# EAGLE design Combo Board (EAGLE 7.5.0)
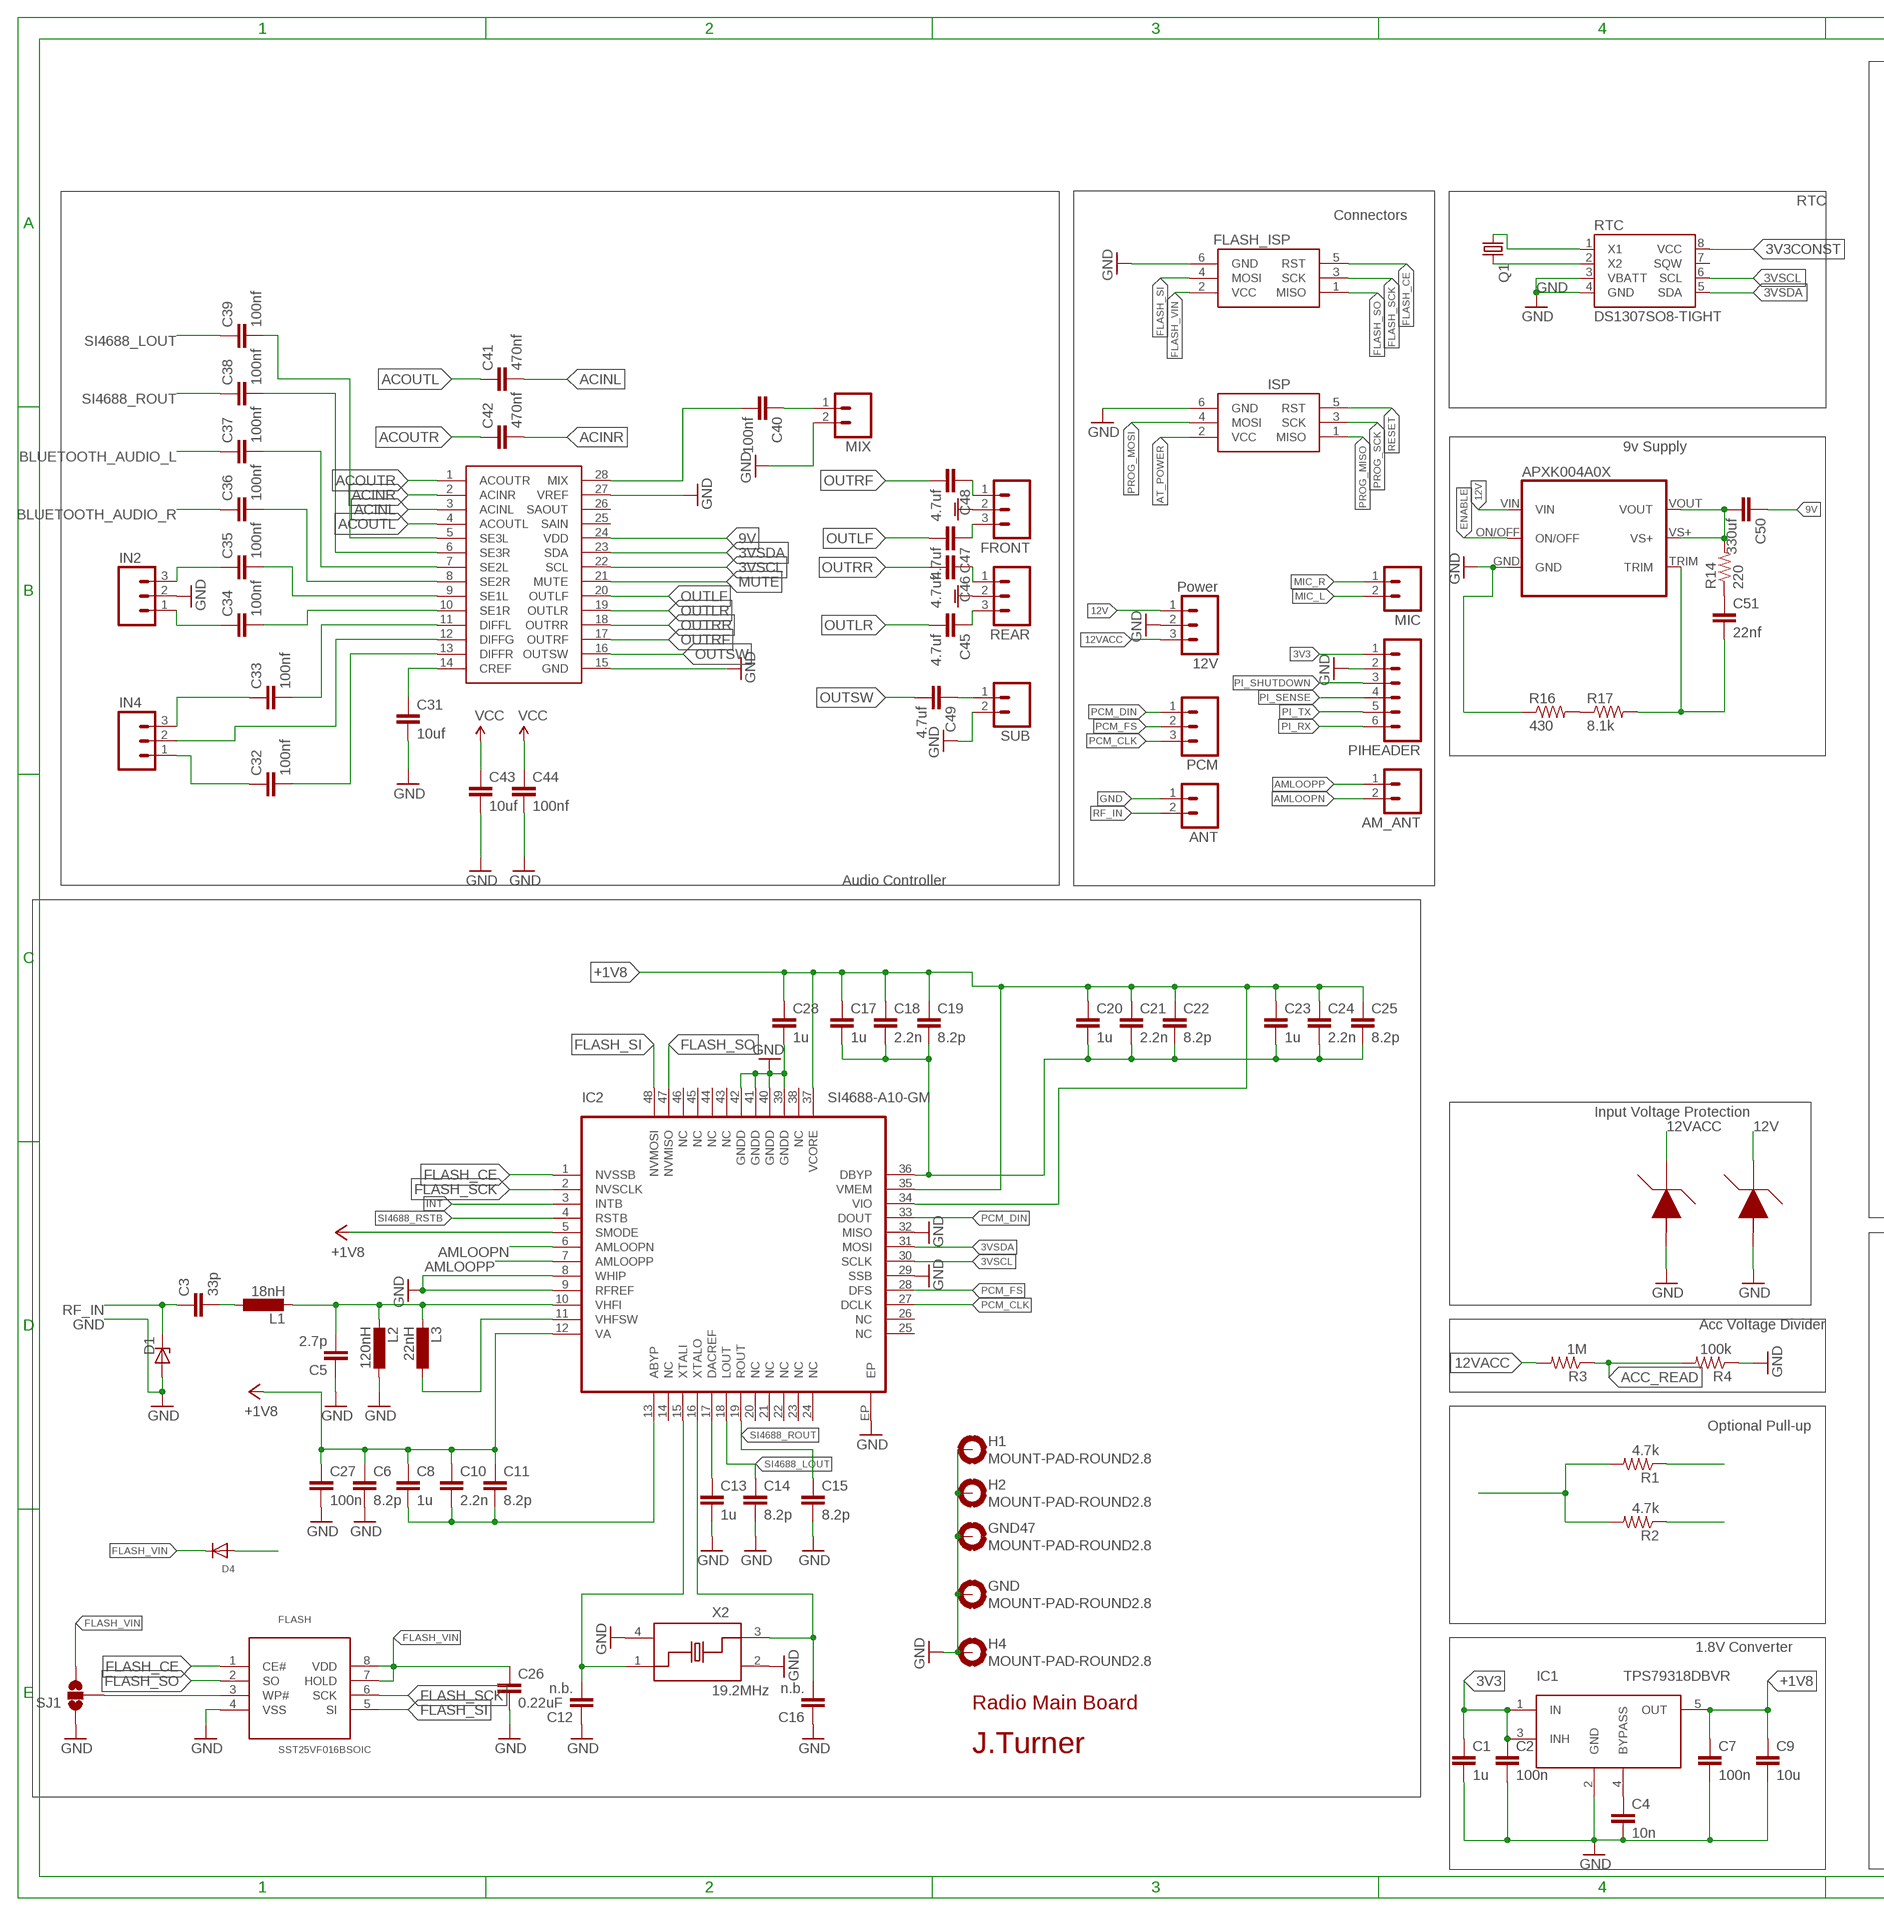
[diagram p0: schematic, sheet 1, part 1 of 2]
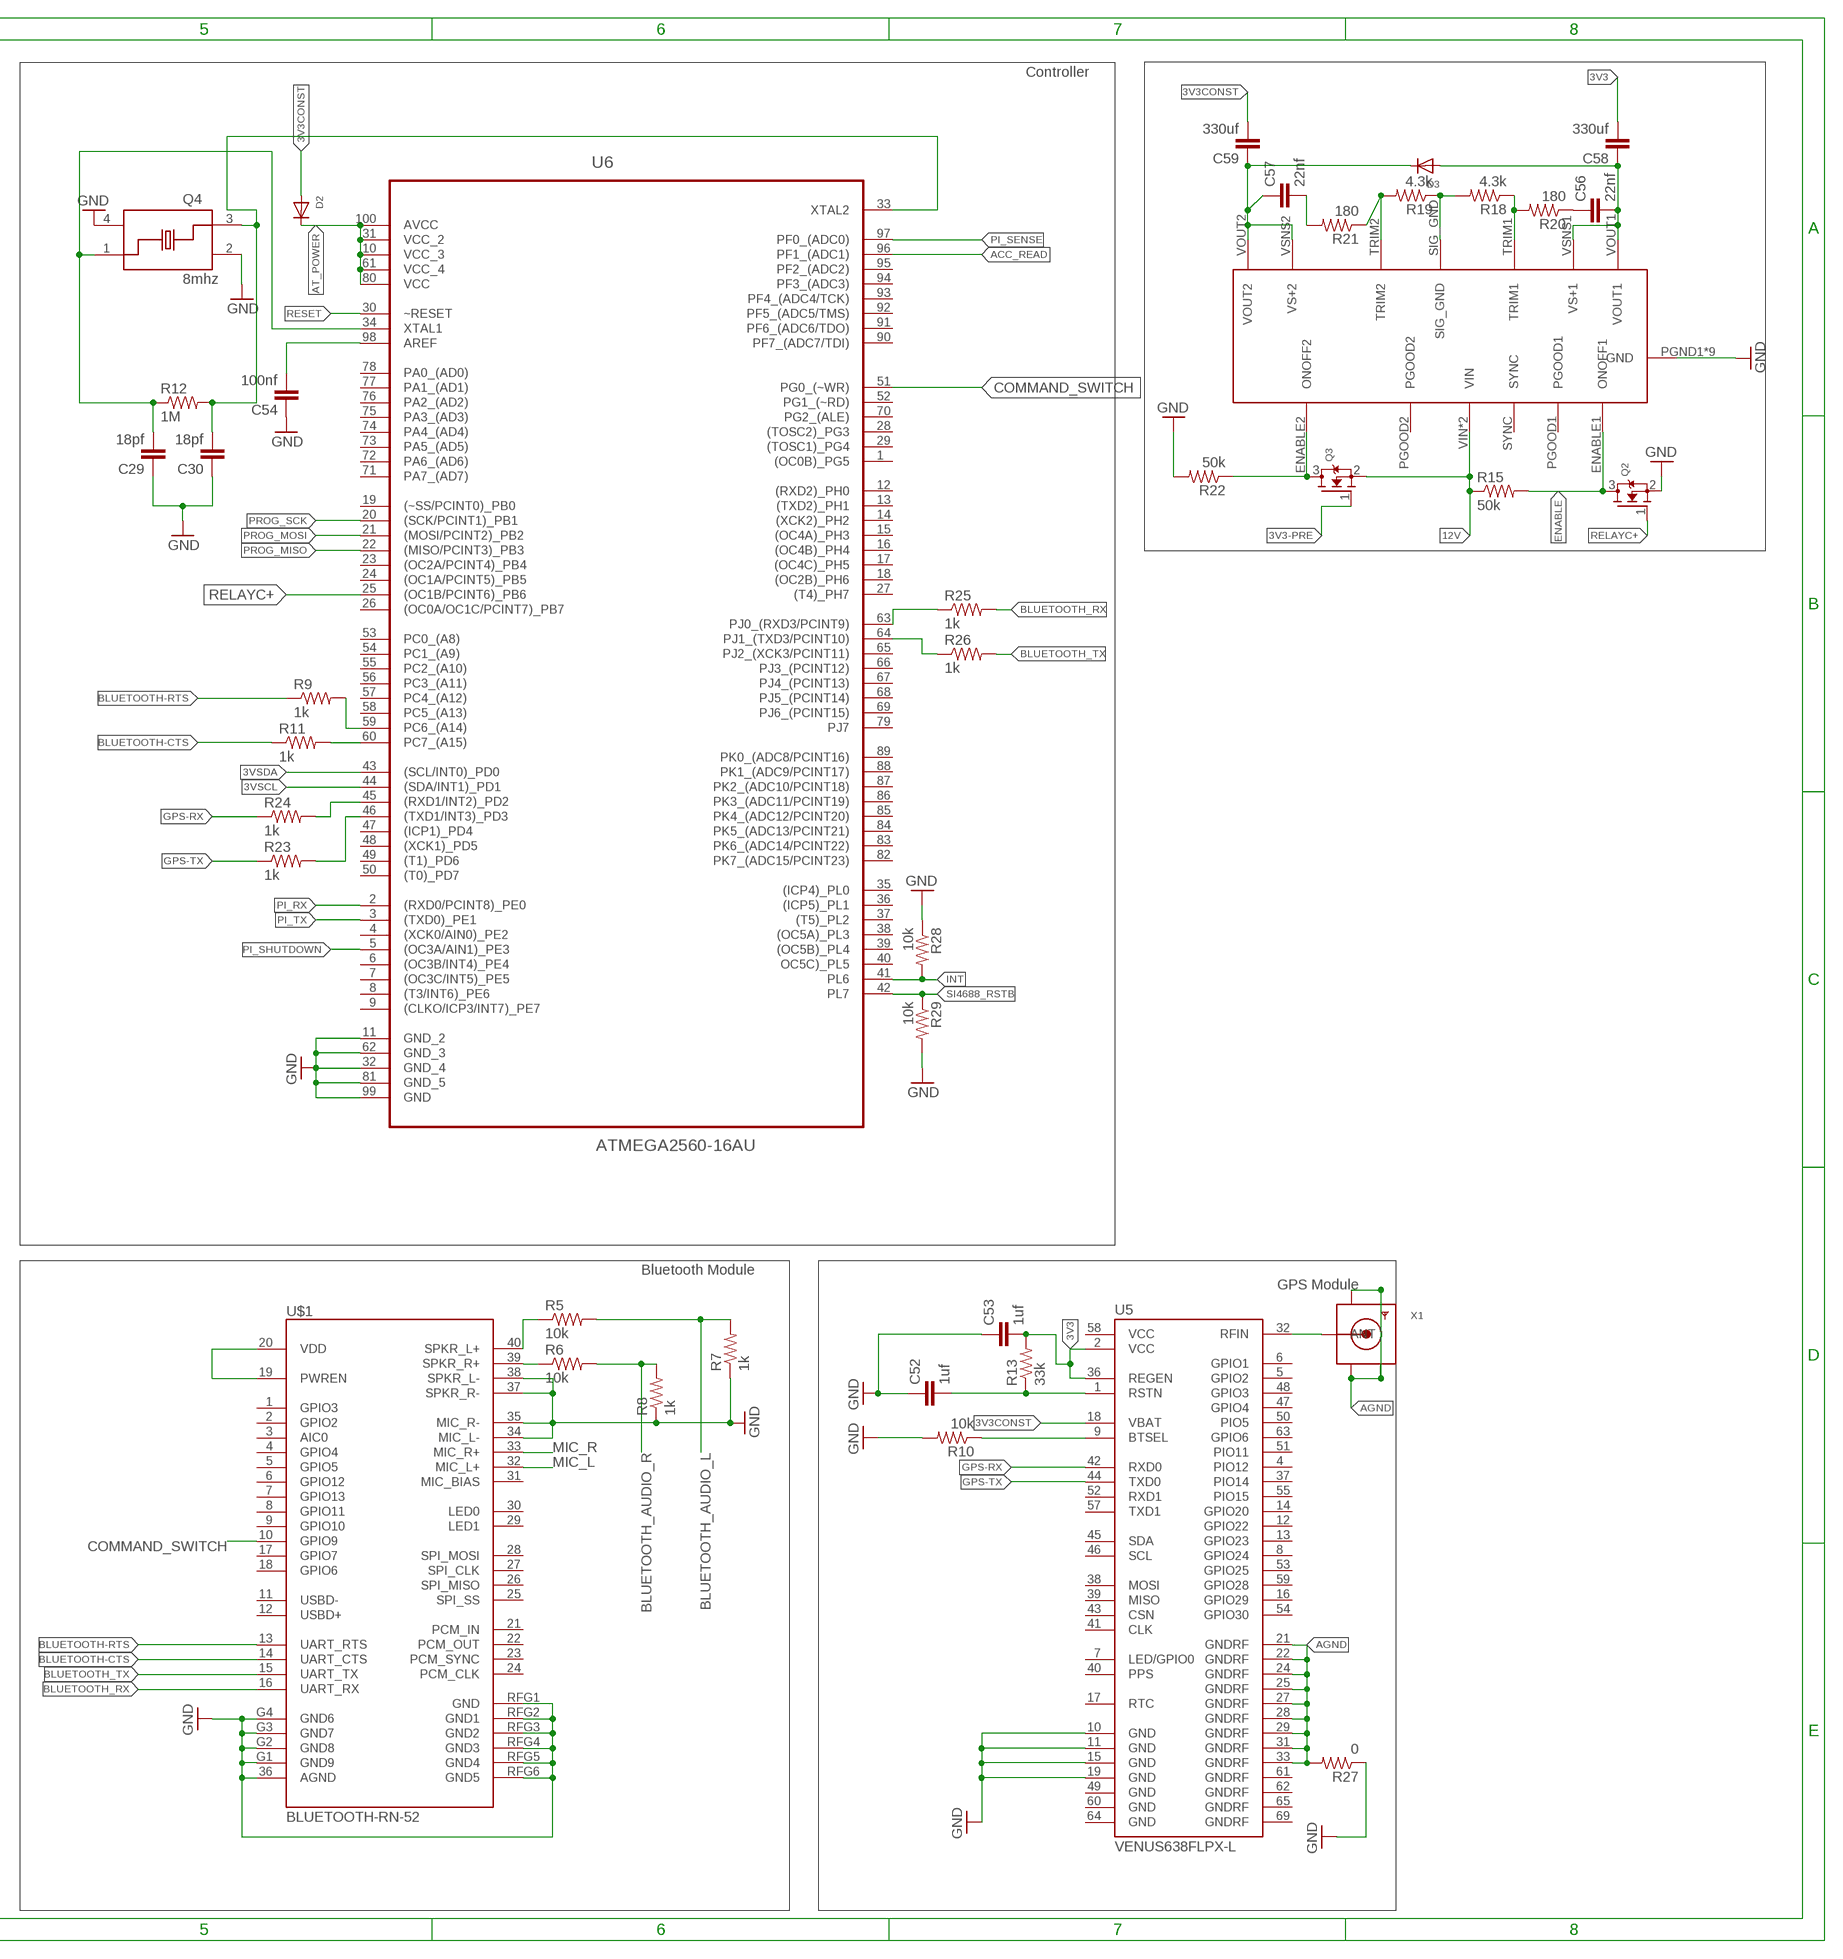
[diagram p1: schematic, sheet 1, part 2 of 2]

## Parts
12V  Power  M03  [03P]
AM_ANT  M02  [02P]
ANT  M02  [02P]
APXK004A0X  APXW005A0X3-SRZ  [APXW005A0X3]
C1  1u  C0603  [SMD0603]
C2  100n  C0603  [SMD0603]
C3  33p  0603CAP  [0603-CAP]
C4  10n  C0603  [SMD0603]
C5  2.7p  0603CAP  [0603-CAP]
C6  8.2p  C0603  [SMD0603]
C7  100n  C0603  [SMD0603]
C8  1u  C0603  [SMD0603]
C9  10u  C0603  [SMD0603]
C10  2.2n  C0603  [SMD0603]
C11  8.2p  C0603  [SMD0603]
C12  n.b.  0603CAP  [0603-CAP]
C13  1u  C0603  [SMD0603]
C14  8.2p  C0603  [SMD0603]
C15  8.2p  C0603  [SMD0603]
C16  n.b.  0603CAP  [0603-CAP]
C17  1u  C0603  [SMD0603]
C18  2.2n  C0603  [SMD0603]
C19  8.2p  C0603  [SMD0603]
C20  1u  C0603  [SMD0603]
C21  2.2n  C0603  [SMD0603]
C22  8.2p  C0603  [SMD0603]
C23  1u  C0603  [SMD0603]
C24  2.2n  C0603  [SMD0603]
C25  8.2p  C0603  [SMD0603]
C26  0.22uF  0603CAP  [0603-CAP]
C27  100n  C0603  [SMD0603]
C28  1u  C0603  [SMD0603]
C29  18pf  0603CAP  [0603-CAP]
C30  18pf  0603CAP  [0603-CAP]
C31  10uf  0603CAP  [0603-CAP]
C32  100nf  0603CAP  [0603-CAP]
C33  100nf  0603CAP  [0603-CAP]
C34  100nf  0603CAP  [0603-CAP]
C35  100nf  0603CAP  [0603-CAP]
C36  100nf  0603CAP  [0603-CAP]
C37  100nf  0603CAP  [0603-CAP]
C38  100nf  0603CAP  [0603-CAP]
C39  100nf  0603CAP  [0603-CAP]
C40  100nf  0603CAP  [0603-CAP]
C41  470nf  0603CAP  [0603-CAP]
C42  470nf  0603CAP  [0603-CAP]
C43  10uf  0603CAP  [0603-CAP]
C44  100nf  0603CAP  [0603-CAP]
C45  4.7uf  0603CAP  [0603-CAP]
C46  4.7uf  0603CAP  [0603-CAP]
C47  4.7uf  0603CAP  [0603-CAP]
C48  4.7uf  0603CAP  [0603-CAP]
C49  4.7uf  0603CAP  [0603-CAP]
C50  330uf  0603CAP  [0603-CAP]
C51  22nf  0603CAP  [0603-CAP]
C52  1uf  C0603  [SMD0603]
C53  1uf  C0603  [SMD0603]
C54  100nf  0603CAP  [0603-CAP]
C56  22nf  0603CAP  [0603-CAP]
C57  22nf  0603CAP  [0603-CAP]
C58  330uf  0603CAP  [0603-CAP]
C59  330uf  0603CAP  [0603-CAP]
D1  ESD9L5.0  [SOD923]
D2  DIODESOD-123  [SOD-123]
D3  DIODESOD-323F  [SOD-323F]
D4  DIODESOD-323F  [SOD-323F]
FLASH  SST25VF016BSOIC  [SOIC8]
FLASH_ISP  AVRISP-6  [AVRISP]
FRONT  M03PTH  [1X03]
GND  MOUNT-PAD-ROUND2.8  [2,8-PAD]
GND47  MOUNT-PAD-ROUND2.8  [2,8-PAD]
H1  MOUNT-PAD-ROUND2.8  [2,8-PAD]
H2  MOUNT-PAD-ROUND2.8  [2,8-PAD]
H4  MOUNT-PAD-ROUND2.8  [2,8-PAD]
IC1  TPS79318DBVR  [SOT23-5]
IC2  SI4688-A10-GM  [QFN48]
IN2  M03  [03P]
IN4  M03  [03P]
ISP  AVRISP-6  [AVRISP]
L1  18nH  L0402  [SMD0402]
L2  120nH  L0402  [SMD0402]
L3  22nH  L0402  [SMD0402]
MIC  M02  [02P]
MIX  M02  [02P]
PCM  M03  [03P]
PIHEADER  M06  [06P]
Q1  CRYSTALTC26H_EZ  [TC26HEZ]
Q2  MOSFET-NREFLOW  [SOT23]
Q3  MOSFET-NREFLOW  [SOT23]
Q4  8mhz  XTAL_3.2X2.5  [XTAL_3.2X2.5]
R1  4.7k  RESISTOR0603  [0603-RES]
R2  4.7k  RESISTOR0603  [0603-RES]
R3  1M  RESISTOR0603  [0603-RES]
R4  100k  RESISTOR0603  [0603-RES]
R5  10k  RESISTOR0603  [0603-RES]
R6  10k  RESISTOR0603  [0603-RES]
R7  1k  RESISTOR0603  [0603-RES]
R8  1k  RESISTOR0603  [0603-RES]
R9  1k  RESISTOR0603  [0603-RES]
R10  10k  RESISTOR0603  [0603-RES]
R11  1k  RESISTOR0603  [0603-RES]
R12  1M  RESISTOR0603  [0603-RES]
R13  33k  RESISTOR0603  [0603-RES]
R14  220  RESISTOR0603  [0603-RES]
R15  50k  RESISTOR0603  [0603-RES]
R16  430  RESISTOR0603  [0603-RES]
R17  8.1k  RESISTOR0603  [0603-RES]
R18  4.3k  RESISTOR0603  [0603-RES]
R19  4.3k  RESISTOR0603  [0603-RES]
R20  180  RESISTOR0603  [0603-RES]
R21  180  RESISTOR0603  [0603-RES]
R22  50k  RESISTOR0603  [0603-RES]
R23  1k  RESISTOR0603  [0603-RES]
R24  1k  RESISTOR0603  [0603-RES]
R25  1k  RESISTOR0603  [0603-RES]
R26  1k  RESISTOR0603  [0603-RES]
R27  0  RESISTOR0603  [0603-RES]
R28  10k  RESISTOR0603  [0603-RES]
R29  10k  RESISTOR0603  [0603-RES]
REAR  M03PTH  [1X03]
RTC  DS1307SO8-TIGHT  [SO08-TIGHT]
SJ1  SOLDERJUMPER_2WAYS  [SJ_3]
SUB  M02  [02P]
TDA  TDA7419  [SOIC-28]
U5  VENUS638FLPX-L  [VENUS638FLPX]
U6  ATMEGA2560-16AU  [QFP50P1600X1600X120-100N]
U$1  BLUETOOTH-RN-52  [RN-52]
U$2  SMCJ12A  [DO-214AC]
U$3  SMCJ12A  [DO-214AC]
U$4  UVXS0606A0X3-SRZ  [UVXS0606]
X1  SMACONNECTOR  [SMA90_DIP]
X2  19.2MHz  XTAL_3.2X2.5  [XTAL_3.2X2.5]

## Nets
3V3: C1.1 C2.1 C53.2 C58.2 D4.A IC1.1(IN) IC1.3(INH) PIHEADER.1 R1.2 R2.2 R13.2 U5.2(VCC) U5.36(REGEN) U$1.19(PWREN) U$1.20(VDD)
3V3-PRE: C56.2 C58.1 D3.A Q3.1(G) U$4.VOUT1 U$4.VSNS1(VS+1)
3V3CONST: C59.2 D2.A RTC.8(VCC) U5.18(VBAT)
3VSCL: IC2.30(SCLK) R1.1 RTC.6(SCL) TDA.22(SCL) U6.44((SDA/INT1)_PD1)
3VSDA: IC2.31(MOSI) R2.1 RTC.5(SDA) TDA.23(SDA) U6.43((SCL/INT0)_PD0)
9V: C43.1 C44.1 C50.1 TDA.24(VDD) ; supply symbol labelled VCC
12V: 12V.1 APXK004A0X.VIN Q3.2(S) R15.1 U$3.NEG(GND) U$4.VIN U$4.VIN2(VIN)
12VACC: 12V.3 R3.2 U$2.NEG(GND)
+1V8: C6.1 C7.1 C8.1 C9.1 C10.1 C11.1 C17.1 C18.1 C19.1 C20.1 C21.1 C22.1 C23.1 C24.1 C25.1 C27.1 C28.1 IC1.5(OUT) IC2.5(SMODE) IC2.12(VA) IC2.34(VIO) IC2.35(VMEM) IC2.37(VCORE)
ACC_READ: R3.1 R4.2 U6.96(PF1_(ADC1))
ACINL: C41.2 TDA.3(ACINL)
ACINR: C42.2 TDA.2(ACINR)
ACOUTL: C41.1 TDA.4(ACOUTL)
ACOUTR: C42.1 TDA.1(ACOUTR)
AGND: R27.2 U5.21(GNDRF) U5.22(GNDRF) U5.24(GNDRF) U5.25(GNDRF) U5.27(GNDRF) U5.28(GNDRF) U5.29(GNDRF) U5.31(GNDRF) U5.33(GNDRF) X1.GND1 X1.GND2 X1.GND3 X1.GND4
AMLOOPN: AM_ANT.2 IC2.6(AMLOOPN)
AMLOOPP: AM_ANT.1 IC2.7(AMLOOPP)
AT_POWER: D2.C ISP.2(VCC) U6.10(VCC_3) U6.31(VCC_2) U6.61(VCC_4) U6.80(VCC) U6.100(AVCC)
BLUETOOTH-CTS: R11.1 U$1.14(UART_CTS)
BLUETOOTH-RTS: R9.1 U$1.13(UART_RTS)
BLUETOOTH_AUDIO_L: C37.1 R5.2 R7.2
BLUETOOTH_AUDIO_R: C36.1 R6.2 R8.2
BLUETOOTH_RX: R25.2 U$1.16(UART_RX)
BLUETOOTH_TX: R26.2 U$1.15(UART_TX)
COMMAND_SWITCH: U6.51(PG0_(~WR)) U$1.10(GPIO9)
CREF: C31.1 TDA.14(CREF)
DIFFG: IN4.2 TDA.12(DIFFG)
DIFFL: C33.2 TDA.11(DIFFL)
DIFFR: C32.2 TDA.13(DIFFR)
ENABLE: APXK004A0X.ON/OFF Q2.3(D) R15.2 U$4.ENABLE1(ONOFF1)
FLASH_CE: FLASH.1(CE#) FLASH_ISP.5(RST) IC2.1(NVSSB)
FLASH_SCK: FLASH.6(SCK) FLASH_ISP.3(SCK) IC2.2(NVSCLK)
FLASH_SI: FLASH.5(SI) FLASH_ISP.4(MOSI) IC2.48(NVMOSI)
FLASH_SO: FLASH.2(SO) FLASH_ISP.1(MISO) IC2.47(NVMISO)
FLASH_VIN: C26.1 D4.C FLASH.7(HOLD) FLASH.8(VDD) FLASH_ISP.2(VCC) SJ1.3
GND: 12V.2 ANT.1 APXK004A0X.GND C1.2 C2.2 C4.2 C5.1 C6.2 C7.2 C9.2 C12.1 C13.2 C14.2 C15.2 C16.1 C26.2 C27.2 C28.2 C29.1 C30.1 C31.2 C43.2 C44.2 C52.1 C53.1 C54.1 D1.A FLASH.4(VSS) FLASH_ISP.6(GND) FRONT.2 GND47.B2,8(MOUNT) GND.B2,8(MOUNT) H1.B2,8(MOUNT) H2.B2,8(MOUNT) H4.B2,8(MOUNT) IC1.2(GND) IC2.8(WHIP) IC2.9(RFREF) IC2.29(SSB) IC2.32(MISO) IC2.39(GNDD) IC2.40(GNDD) IC2.41(GNDD) IC2.42(GNDD) IC2.EP IN2.2 ISP.6(GND) L2.1 MIX.2 PIHEADER.2 Q2.2(S) Q4.2(GND) Q4.4(GND) R4.1 R7.1 R8.1 R10.2 R16.1 R22.2 R27.1 R28.1 R29.2 REAR.2 RTC.3(VBATT) RTC.4(GND) SJ1.1 SUB.2 TDA.15(GND) TDA.27(VREF) U5.10(GND) U5.11(GND) U5.15(GND) U5.19(GND) U6.11(GND_2) U6.32(GND_4) U6.62(GND_3) U6.81(GND_5) U6.99(GND) U$1.34(MIC_L-) U$1.35(MIC_R-) U$1.36(AGND) U$1.37(SPKR_R-) U$1.38(SPKR_L-) U$1.G1(GND9) U$1.G2(GND8) U$1.G3(GND7) U$1.G4(GND6) U$1.RFG1(GND) U$1.RFG2(GND1) U$1.RFG3(GND2) U$1.RFG4(GND3) U$1.RFG5(GND4) U$1.RFG6(GND5) U$2.POS(VIN) U$3.POS(VIN) U$4.PGND1(GND) U$4.PGND2(GND) U$4.PGND3(GND) U$4.PGND4(GND) U$4.PGND5(GND) U$4.PGND6(GND) U$4.PGND7(GND) U$4.PGND8(GND) U$4.PGND9(GND) X2.2(GND) X2.4(GND) ; supply symbol labelled AGND
GPS-RX: R24.1 U5.42(RXD0)
GPS-TX: R23.1 U5.44(TXD0)
INT: IC2.3(INTB) R28.2 U6.41(PL6)
MIC_L: MIC.2 U$1.32(MIC_L+)
MIC_R: MIC.1 U$1.33(MIC_R+)
MIX: C40.2 TDA.28(MIX)
MUTE: TDA.21(MUTE)
N$1: C3.2 L1.1
N$2: C5.2 IC2.10(VHFI) L1.2 L2.2 L3.2
N$3: IC2.11(VHFSW) L3.1
N$4: C8.2 C10.2 C11.2 IC2.13(ABYP)
N$5: C17.2 C18.2 C19.2 C20.2 C21.2 C22.2 C23.2 C24.2 C25.2 IC2.36(DBYP)
N$6: C12.2 IC2.15(XTALI) X2.1
N$7: C16.2 IC2.16(XTALO) X2.3
N$8: C13.1 IC2.17(DACREF)
N$10: R9.2 U6.59(PC6_(A14))
N$11: C4.1 IC1.4(BYPASS)
N$12: R11.2 U6.60(PC7_(A15))
N$13: C30.2 Q4.3 R12.2 U6.33(XTAL2)
N$14: FLASH.3(WP#) SJ1.2
N$15: R5.1 U$1.40(SPKR_L+)
N$16: R6.1 U$1.39(SPKR_R+)
N$17: APXK004A0X.TRIM C51.2 R17.2
N$18: C40.1 MIX.1
N$19: Q1.2 RTC.2(X2)
N$20: Q1.1 RTC.1(X1)
N$21: C35.1 IN2.3
N$22: C34.1 IN2.1
N$23: R23.2 U6.46((TXD1/INT3)_PD3)
N$24: C29.2 Q4.1 R12.1 U6.34(XTAL1)
N$25: C33.1 IN4.3
N$26: C32.1 IN4.1
N$28: R24.2 U6.45((RXD1/INT2)_PD2)
N$29: R16.2 R17.1
N$30: R10.1 U5.9(BTSEL)
N$31: C52.2 R13.1 U5.1(RSTN)
N$32: C48.1 FRONT.1
N$33: C47.1 FRONT.3
N$34: C46.1 REAR.1
N$35: C45.1 REAR.3
N$36: C49.1 SUB.1
N$37: APXK004A0X.VOUT APXK004A0X.VS+ C50.2 R14.2
N$38: C51.1 R14.1
N$45: R19.2 R21.1 U$4.TRIM2
N$46: R18.1 R20.2 U$4.TRIM1
N$47: C56.1 R20.1
N$48: C57.2 R21.2
N$49: R18.2 R19.1 U$4.SIG_GND
N$50: C57.1 C59.1 D3.C U$4.VOUT2 U$4.VSNS2(VS+2)
N$51: R25.1 U6.63(PJ0_(RXD3/PCINT9))
N$52: R26.1 U6.64(PJ1_(TXD3/PCINT10))
N$53: Q3.3(D) R22.1 U$4.ENABLE2(ONOFF2)
N$54: C54.2 U6.98(AREF)
N$55: U5.32(RFIN) X1.ANTENNA(ANT)
OUTLF: C47.2 TDA.20(OUTLF)
OUTLR: C45.2 TDA.19(OUTLR)
OUTRF: C48.2 TDA.17(OUTRF)
OUTRR: C46.2 TDA.18(OUTRR)
OUTSW: C49.2 TDA.16(OUTSW)
PCM_CLK: IC2.27(DCLK) PCM.3
PCM_DIN: IC2.33(DOUT) PCM.1
PCM_FS: IC2.28(DFS) PCM.2
PI_RX: PIHEADER.6 U6.2((RXD0/PCINT8)_PE0)
PI_SENSE: PIHEADER.4 U6.97(PF0_(ADC0))
PI_SHUTDOWN: PIHEADER.3 U6.5((OC3A/AIN1)_PE3)
PI_TX: PIHEADER.5 U6.3((TXD0)_PE1)
PROG_MISO: ISP.1(MISO) U6.22((MISO/PCINT3)_PB3)
PROG_MOSI: ISP.4(MOSI) U6.21((MOSI/PCINT2)_PB2)
PROG_SCK: ISP.3(SCK) U6.20((SCK/PCINT1)_PB1)
RELAYC+: Q2.1(G) U6.25((OC1B/PCINT6)_PB6)
RESET: ISP.5(RST) U6.30(~RESET)
RF_IN: ANT.2 C3.1 D1.K(C)
SE1L: C35.2 TDA.9(SE1L)
SE1R: C34.2 TDA.10(SE1R)
SE2L: C37.2 TDA.7(SE2L)
SE2R: C36.2 TDA.8(SE2R)
SE3L: C39.2 TDA.5(SE3L)
SE3R: C38.2 TDA.6(SE3R)
SI4688_LOUT: C14.1 C39.1 IC2.18(LOUT)
SI4688_ROUT: C15.1 C38.1 IC2.19(ROUT)
SI4688_RSTB: IC2.4(RSTB) R29.1 U6.42(PL7)
Unconnected: IC2.14(NC) IC2.20(NC) IC2.21(NC) IC2.22(NC) IC2.23(NC) IC2.24(NC) IC2.25(NC) IC2.26(NC) IC2.38(NC) IC2.43(NC) IC2.44(NC) IC2.45(NC) IC2.46(NC) RTC.7(SQW) TDA.25(SAIN) TDA.26(SAOUT) U5.4(PIO12) U5.5(GPIO2) U5.6(GPIO1) U5.7(LED/GPIO0) U5.8(GPIO24) U5.12(GPIO22) U5.13(GPIO23) U5.14(GPIO20) U5.16(GPIO29) U5.17(RTC) U5.37(PIO14) U5.38(MOSI) U5.39(MISO) U5.40(PPS) U5.41(CLK) U5.43(CSN) U5.45(SDA) U5.46(SCL) U5.47(GPIO4) U5.48(GPIO3) U5.49(GND) U5.50(PIO5) U5.51(PIO11) U5.52(RXD1) U5.53(GPIO25) U5.54(GPIO30) U5.55(PIO15) U5.57(TXD1) U5.58(VCC) U5.59(GPIO28) U5.60(GND) U5.61(GNDRF) U5.62(GNDRF) U5.63(GPIO6) U5.64(GND) U5.65(GNDRF) U5.69(GNDRF) U6.1((OC0B)_PG5) U6.4((XCK0/AIN0)_PE2) U6.6((OC3B/INT4)_PE4) U6.7((OC3C/INT5)_PE5) U6.8((T3/INT6)_PE6) U6.9((CLKO/ICP3/INT7)_PE7) U6.12((RXD2)_PH0) U6.13((TXD2)_PH1) U6.14((XCK2)_PH2) U6.15((OC4A)_PH3) U6.16((OC4B)_PH4) U6.17((OC4C)_PH5) U6.18((OC2B)_PH6) U6.19((~SS/PCINT0)_PB0) U6.23((OC2A/PCINT4)_PB4) U6.24((OC1A/PCINT5)_PB5) U6.26((OC0A/OC1C/PCINT7)_PB7) U6.27((T4)_PH7) U6.28((TOSC2)_PG3) U6.29((TOSC1)_PG4) U6.35((ICP4)_PL0) U6.36((ICP5)_PL1) U6.37((T5)_PL2) U6.38((OC5A)_PL3) U6.39((OC5B)_PL4) U6.40(OC5C)_PL5) U6.47((ICP1)_PD4) U6.48((XCK1)_PD5) U6.49((T1)_PD6) U6.50((T0)_PD7) U6.52(PG1_(~RD)) U6.53(PC0_(A8)) U6.54(PC1_(A9)) U6.55(PC2_(A10)) U6.56(PC3_(A11)) U6.57(PC4_(A12)) U6.58(PC5_(A13)) U6.65(PJ2_(XCK3/PCINT11)) U6.66(PJ3_(PCINT12)) U6.67(PJ4_(PCINT13)) U6.68(PJ5_(PCINT14)) U6.69(PJ6_(PCINT15)) U6.70(PG2_(ALE)) U6.71(PA7_(AD7)) U6.72(PA6_(AD6)) U6.73(PA5_(AD5)) U6.74(PA4_(AD4)) U6.75(PA3_(AD3)) U6.76(PA2_(AD2)) U6.77(PA1_(AD1)) U6.78(PA0_(AD0)) U6.79(PJ7) U6.82(PK7_(ADC15/PCINT23)) U6.83(PK6_(ADC14/PCINT22)) U6.84(PK5_(ADC13/PCINT21)) U6.85(PK4_(ADC12/PCINT20)) U6.86(PK3_(ADC11/PCINT19)) U6.87(PK2_(ADC10/PCINT18)) U6.88(PK1_(ADC9/PCINT17)) U6.89(PK0_(ADC8/PCINT16)) U6.90(PF7_(ADC7/TDI)) U6.91(PF6_(ADC6/TDO)) U6.92(PF5_(ADC5/TMS)) U6.93(PF4_(ADC4/TCK)) U6.94(PF3_(ADC3)) U6.95(PF2_(ADC2)) U$1.1(GPIO3) U$1.2(GPIO2) U$1.3(AIC0) U$1.4(GPIO4) U$1.5(GPIO5) U$1.6(GPIO12) U$1.7(GPIO13) U$1.8(GPIO11) U$1.9(GPIO10) U$1.11(USBD-) U$1.12(USBD+) U$1.17(GPIO7) U$1.18(GPIO6) U$1.21(PCM_IN) U$1.22(PCM_OUT) U$1.23(PCM_SYNC) U$1.24(PCM_CLK) U$1.25(SPI_SS) U$1.26(SPI_MISO) U$1.27(SPI_CLK) U$1.28(SPI_MOSI) U$1.29(LED1) U$1.30(LED0) U$1.31(MIC_BIAS) U$4.PGOOD1 U$4.PGOOD2 U$4.SYNC

## Notes on the sheet
- Controller
- RTC
- Connectors
- 9v Supply
- Audio Controller
- Input Voltage Protection
- Bluetooth Module
- GPS Module
- Acc Voltage Divider
- Optional Pull-up
- 1.8V Converter
- Radio Main Board
- J.Turner

## Library data of the parts
12V IN2 IN4 PCM = con-amp-quick:M03: AMP QUICK CONNECTOR; OC_FARNELL: unknown; OC_NEWARK: unknown
AM_ANT ANT MIC MIX SUB = con-amp-quick:M02: AMP QUICK CONNECTOR; OC_FARNELL: unknown; OC_NEWARK: unknown
APXK004A0X = john:APXW005A0X3-SRZ
C1 C2 C4 C6-C11 C13-C15 C17-C25 C27 C28 C52 C53 = generisch:C0603
C3 C5 C12 C16 C26 C29-C51 C54 C56-C59 = john:0603CAP
D1 = generisch:ESD9L5.0
D2-D4 = adafruit:DIODE: Diode SMADIODE - SMA Surface Mount Package 20V 1A Schottky Diode Digikey: 641-1014-6-ND DO-1N4148 - Through Hole Small Current Diode SOD-123 20V 1 A (.5mV Vf) Schottky Diode - Digikey: MBRX120TPMSCT-ND SOD-323 10V 570mA (.38mV Vf, 3ns) Schottky Diode - Digikey: ZLLS410CT-ND SOD-523 30V 30mA Schottky Diode (RB751S-40TE61) - Digikey: RB751S-40TE61CT-ND SOT23-R/W - SOT23 Package (R = Solder Paste/Reflow Ovens, W = Hand-Soldering) BAT54Film 40V 300mA - Digikey: 497-7162-1-ND
FLASH = john:SST25VF016B
FLASH_ISP ISP = adafruit:AVRISP: AVR ISP HEADER Standard 6 pin header for AVR programming
FRONT REAR = SparkFun-Connectors:M03: Header 3 Standard 3-pin 0.1" header. Use with straight break away headers (SKU : PRT-00116), right angle break away headers (PRT-00553), swiss pins (PRT-00743), machine pins (PRT-00117), and female headers (PRT-00115). Molex polarized connector foot print use with SKU : PRT-08232 with associated crimp pins and housings.
GND GND47 H1 H2 H4 = holes:MOUNT-PAD-ROUND: MOUNTING PAD, round
IC1 = ldo_reg:TPS79318DBVR
IC2 = SI4688-A10-GM:SI4688-A10-GM
L1-L3 = generisch:L0402
PIHEADER = con-amp-quick:M06: AMP QUICK CONNECTOR; OC_FARNELL: unknown; OC_NEWARK: unknown
Q1 = SparkFun-FreqCtrl:CRYSTAL: Various standard crystals. Proven footprints.
Q2 Q3 = adafruit:MOSFET-N: N-Channel Mosfet 2N7002E - 60V 260mA SOT23 [Digikey: 2N7002ET1GOSTR-ND] - REEL BSH103 - 30V 850mA SOT23 [Digikey: 568-5013-1-ND]
Q4 X2 = generisch:XTAL_3.2X2.5
R1-R29 = john:RESISTOR: Resistor Basic schematic elements and footprints for 0603, 1206, and PTH resistors.
RTC = SparkFun-FreqCtrl:DS1307: I2C real-time clock with battery backup.; PROD_ID: IC-08138
SJ1 = SparkFun-Retired:SOLDERJUMPER_2WAY: Solder Jumper 2 way solder jumper
TDA = john:TDA7419
U5 = SparkFun-RF:VENUS638FLPX-L: Venus638FLPX-L GPS Receiver Venus638FLPx is a high performance, low cost, single chip GPS receiver targeting mobile consumer and cellular handset applications. It offers very low power consumption, high sensitivity, and best in class signal acquisition and time-to-first-fix performance. Venus638FLPx contains all the necessary components of a complete GPS receiver, includes 1.2dB cascaded system NF RF front-end, GPS baseband signal processor, 0.5ppm TCXO, 32.768kHz RTC crystal, RTC LDO regulator, and passive components. It requires very low external component count and takes up only 100mm2 PCB footprint. Dedicated massive-correlator signal parameter search engine within the baseband enables rapid search of all the available satellites and acquisition of very weak signal. An advanced track engine allows weak signal tracking and positioning in harsh environments such as urban canyons and under deep foliage. The self-contained architecture keeps GPS processing off the host and allows integration into applications with very little resource. FEATURES 20Hz update rate -148dBm cold start sensitivity -165dBm tracking sensitivity 29 second cold start TTFF 3.5 second TTFF with AGPS 1 second hot start 2.5m accuracy Multipath detection and suppression Jamming detection and mitigation SBAS (WAAS / EGNOS) support 7-day extended ephemeris AGPS 67mW full power navigation Works directly with active or passive antenna Internal flash for optional 75K point data logging Supports external SPI flash memory data logging Complete receiver in 10mm x 10mm x 1.3mm size Contains LNA, SAW Filter, TCXO, RTC Xtal, LDO Pb-free RoHS compliant
U6 = Atmel_By_element14_Batch_1-00:ATMEGA2560-16AU: Microcontroller; DESCRIPTION: Microcontroller; MPN: ATMEGA2560-16AU; OC_FARNELL: 1288330; OC_NEWARK: 23M5051; PACKAGE: LQFP-100; SUPPLIER: ATMEL
U$1 = SparkFun-RF:BLUETOOTH-RN-52
U$2 U$3 = john:SMCJ12A
U$4 = john:UVXS0606A0X3-SRZ
X1 = adafruit:SMACONNECTOR: SMA Connector 90° DIP SMA Connector, 50 Ohm (4UConnector: 07259)

## Board
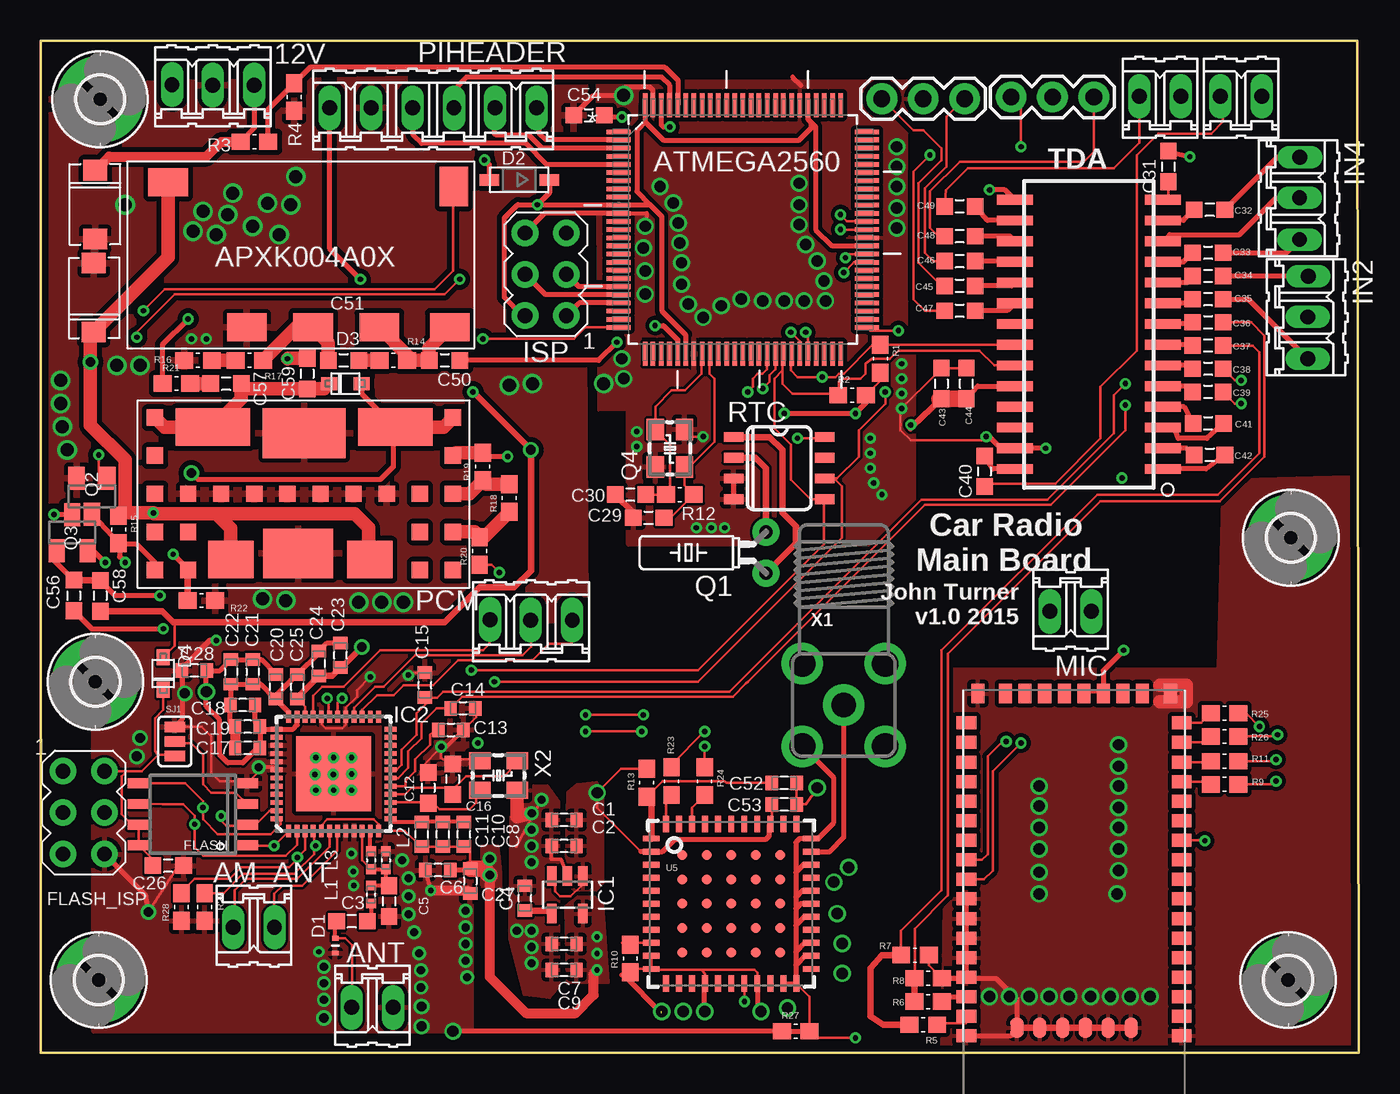
[diagram p2: board, top side]
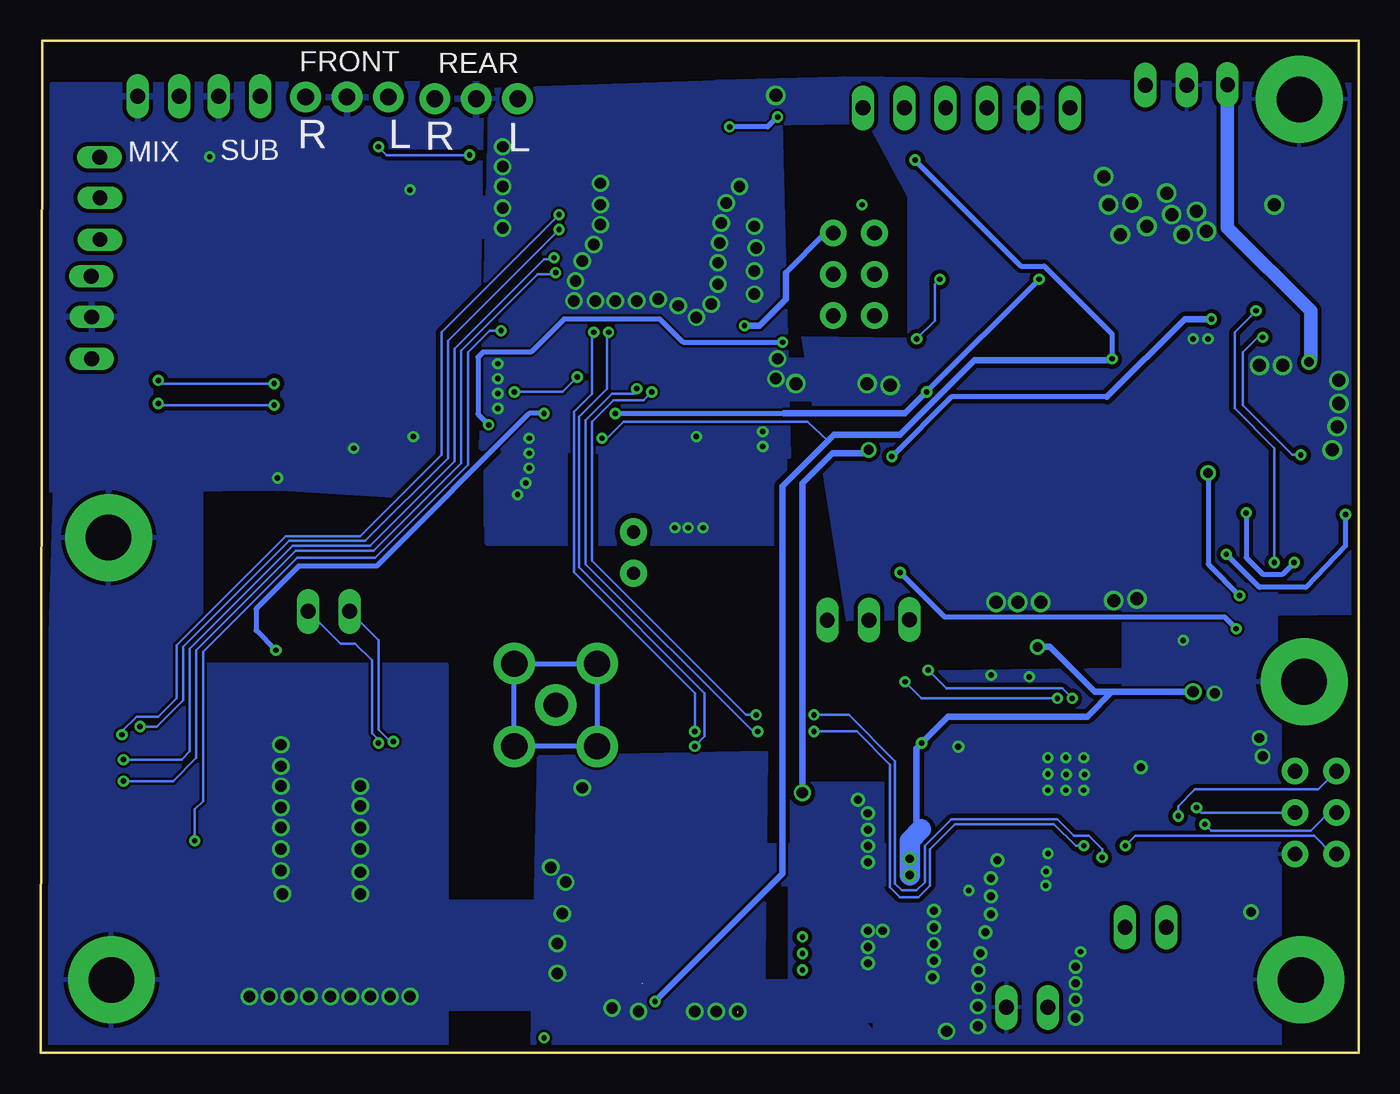
[diagram p3: board, bottom side, seen from below]

Size 80.87 x 62.08 mm. Coordinates in mm from the lower left corner, seen from the top.
Outline: 0,62.08 0,0 80.87,0 80.77,62.08 0,62.08
Copper layers (1*16): Top 0.0356mm / dielectric 1.5011mm / Bottom 0.0356mm
Design rules "LaenPCBOrder": minimum track width 6mil, minimum drill 13mil, track to track 6mil, track to pad 6mil, pad to pad 6mil, via to via 6mil, smd to smd 6mil, copper to edge 15mil, drill to drill 6mil, minimum pad ring 7mil, minimum via ring 7mil, stop-mask expansion 3mil, vias tented up to drill 0mil, thermal gap 10mil

### Footprints (pad centres in the part's own frame; a part is rotated, then mirrored left to right if it is on the bottom)
03P = drill 0.914 long: 1 -2.515,0.254; 2 -0.025,0.229; 3 2.54,0.229
02P = drill 0.914 long: 1 -1.27,0.254; 2 1.27,0.254
APXW005A0X3 = smd 2.44 x 1.73: GND 13.97,10.16; TRIM 9.91,10.16; VIN 18.8,1.27; VOUT 5.84,10.16; VS+ 1.52,10.16 | smd 1.73 x 2.44: ON/OFF 1.27,1.52
SMD0603 = smd 0.762 x 0.889: 1 -0.762,0; 2 0.762,0
0603-CAP = smd 1.016 x 1: 1 -0.926,0 | smd 1.024 x 1: 2 0.952,0
SOD923 = smd 0.3 x 0.4: A -0.45,0; K 0.45,0
SOD-123 = smd 1.2 x 0.7: A 1.85,0; C -1.85,0
SOD-323F = smd 1 x 0.8: A -1,0; C 1,0
SOIC8 = smd 0.6 x 1.36: 1 -1.905,-2.6; 2 -0.635,-2.6; 3 0.635,-2.6; 4 1.905,-2.6; 5 1.905,4.05; 6 0.635,4.05; 7 -0.635,4.05; 8 -1.905,4.05
AVRISP = drill 0.9 pad 1.626: 1 -1.27,2.54; 2 1.27,2.54; 3 -1.27,0; 4 1.27,0; 5 -1.27,-2.54; 6 1.27,-2.54
1X03 = drill 1.016 pad 1.88: 1 0,0; 2 2.54,0; 3 5.08,0
2,8-PAD = drill 2.8 pad 5.334: B2,8 0,0
SOT23-5 = smd 0.6 x 1.2: 1 -0.95,-1.15; 2 0,-1.15; 3 0.95,-1.15; 4 0.95,1.15; 5 -0.95,1.15
QFN48 = smd 0.75 x 0.3: 1 -3.5,2.75; 2 -3.5,2.25; 3 -3.5,1.75; 4 -3.5,1.25; 5 -3.5,0.75; 6 -3.5,0.25; 7 -3.5,-0.25; 8 -3.5,-0.75; 9 -3.5,-1.25; 10 -3.5,-1.75; 11 -3.5,-2.25; 12 -3.5,-2.75; 25 3.5,-2.75; 26 3.5,-2.25; 27 3.5,-1.75; 28 3.5,-1.25; 29 3.5,-0.75; 30 3.5,-0.25; 31 3.5,0.25; 32 3.5,0.75; 33 3.5,1.25; 34 3.5,1.75; 35 3.5,2.25; 36 3.5,2.75 | smd 0.3 x 0.75: 13 -2.75,-3.5; 14 -2.25,-3.5; 15 -1.75,-3.5; 16 -1.25,-3.5; 17 -0.75,-3.5; 18 -0.25,-3.5; 19 0.25,-3.5; 20 0.75,-3.5; 21 1.25,-3.5; 22 1.75,-3.5; 23 2.25,-3.5; 24 2.75,-3.5; 37 2.75,3.5; 38 2.25,3.5; 39 1.75,3.5; 40 1.25,3.5; 41 0.75,3.5; 42 0.25,3.5; 43 -0.25,3.5; 44 -0.75,3.5; 45 -1.25,3.5; 46 -1.75,3.5; 47 -2.25,3.5; 48 -2.75,3.5 | smd 4.6 x 4.6: EP 0,0
SMD0402 = smd 0.6 x 0.6: 1 -0.55,0; 2 0.55,0
06P = drill 0.914 long: 1 -6.35,0.254; 2 -3.81,0.254; 3 -1.27,0.254; 4 1.27,0.254; 5 3.81,0.254; 6 6.35,0.254
TC26HEZ = drill 0.813 pad 1.676: 1 -1.27,0; 2 1.27,0
SOT23 = smd 1 x 1.4: 1 -0.95,-1.1; 2 0.95,-1.1; 3 0,1.1
XTAL_3.2X2.5 = smd 1.3 x 1.05: 1 -1.15,-0.9; 2 1.15,-0.9; 3 1.15,0.9; 4 -1.15,0.9
0603-RES = smd 1.1 x 1: 1 -0.85,0; 2 0.85,0
SO08-TIGHT = smd 0.6 x 1.2: 1 -1.905,-2.8; 2 -0.635,-2.8; 3 0.635,-2.8; 4 1.905,-2.8; 5 1.905,2.8; 6 0.635,2.8; 7 -0.635,2.8; 8 -1.905,2.8
SJ_3 = smd 0.635 x 1.27: 1 -0.889,0; 2 0,0; 3 0.889,0
SOIC-28 = smd 0.6 x 2.2: 1 8.89,4.548; 2 7.62,4.548; 3 6.35,4.548; 4 5.08,4.548; 5 3.81,4.548; 6 2.54,4.548; 7 1.27,4.548; 8 0,4.548; 9 -1.27,4.548; 10 -2.54,4.548; 11 -3.81,4.548; 12 -5.08,4.548; 13 -6.35,4.548; 14 -7.62,4.548; 15 -7.62,-4.548; 16 -6.35,-4.548; 17 -5.08,-4.548; 18 -3.81,-4.548; 19 -2.54,-4.548; 20 -1.27,-4.548; 21 0,-4.548; 22 1.27,-4.548; 23 2.54,-4.548; 24 3.81,-4.548; 25 5.08,-4.548; 26 6.35,-4.548; 27 7.62,-4.548; 28 8.89,-4.548
VENUS638FLPX = smd 1 x 0.36: 1 -4.9,4; 2 -4.9,3.2; 3 -4.9,2.4; 4 -4.9,1.6; 5 -4.9,0.8; 6 -4.9,0; 7 -4.9,-0.8; 8 -4.9,-1.6; 9 -4.9,-2.4; 10 -4.9,-3.2; 11 -4.9,-4; 23 4.9,-4; 24 4.9,-3.2; 25 4.9,-2.4; 26 4.9,-1.6; 27 4.9,-0.8; 28 4.9,0; 29 4.9,0.8; 30 4.9,1.6; 31 4.9,2.4; 32 4.9,3.2; 33 4.9,4 | smd 0.36 x 1: 12 -4,-4.9; 13 -3.2,-4.9; 14 -2.4,-4.9; 15 -1.6,-4.9; 16 -0.8,-4.9; 17 0,-4.9; 18 0.8,-4.9; 19 1.6,-4.9; 20 2.4,-4.9; 21 3.2,-4.9; 22 4,-4.9; 34 4,4.9; 35 3.2,4.9; 36 2.4,4.9; 37 1.6,4.9; 38 0.8,4.9; 39 0,4.9; 40 -0.8,4.9; 41 -1.6,4.9; 42 -2.4,4.9; 43 -3.2,4.9; 44 -4,4.9 | smd 0.6 x 0.6: 45 -3,3; 46 -3,1.5; 47 -3,0; 48 -3,-1.5; 49 -3,-3; 50 -1.5,3; 51 -1.5,1.5; 52 -1.5,0; 53 -1.5,-1.5; 54 -1.5,-3; 55 0,3; 56 0,1.5; 57 0,0; 58 0,-1.5; 59 0,-3; 60 1.5,3; 61 1.5,1.5; 62 1.5,0; 63 1.5,-1.5; 64 1.5,-3; 65 3,3; 66 3,1.5; 67 3,0; 68 3,-1.5; 69 3,-3
QFP50P1600X1600X120-100N = smd 1.473 x 0.279: 1 -7.62,5.994; 2 -7.62,5.512; 3 -7.62,5.004; 4 -7.62,4.496; 5 -7.62,3.988; 6 -7.62,3.505; 7 -7.62,2.997; 8 -7.62,2.489; 9 -7.62,2.007; 10 -7.62,1.499; 11 -7.62,0.991; 12 -7.62,0.508; 13 -7.62,0; 14 -7.62,-0.508; 15 -7.62,-0.991; 16 -7.62,-1.499; 17 -7.62,-2.007; 18 -7.62,-2.489; 19 -7.62,-2.997; 20 -7.62,-3.505; 21 -7.62,-3.988; 22 -7.62,-4.496; 23 -7.62,-5.004; 24 -7.62,-5.512; 25 -7.62,-5.994; 51 7.62,-5.994; 52 7.62,-5.512; 53 7.62,-5.004; 54 7.62,-4.496; 55 7.62,-3.988; 56 7.62,-3.505; 57 7.62,-2.997; 58 7.62,-2.489; 59 7.62,-2.007; 60 7.62,-1.499; 61 7.62,-0.991; 62 7.62,-0.508; 63 7.62,0; 64 7.62,0.508; 65 7.62,0.991; 66 7.62,1.499; 67 7.62,2.007; 68 7.62,2.489; 69 7.62,2.997; 70 7.62,3.505; 71 7.62,3.988; 72 7.62,4.496; 73 7.62,5.004; 74 7.62,5.512; 75 7.62,5.994 | smd 0.279 x 1.473: 26 -5.994,-7.62; 27 -5.512,-7.62; 28 -5.004,-7.62; 29 -4.496,-7.62; 30 -3.988,-7.62; 31 -3.505,-7.62; 32 -2.997,-7.62; 33 -2.489,-7.62; 34 -2.007,-7.62; 35 -1.499,-7.62; 36 -0.991,-7.62; 37 -0.508,-7.62; 38 0,-7.62; 39 0.508,-7.62; 40 0.991,-7.62; 41 1.499,-7.62; 42 2.007,-7.62; 43 2.489,-7.62; 44 2.997,-7.62; 45 3.505,-7.62; 46 3.988,-7.62; 47 4.496,-7.62; 48 5.004,-7.62; 49 5.512,-7.62; 50 5.994,-7.62; 76 5.994,7.62; 77 5.512,7.62; 78 5.004,7.62; 79 4.496,7.62; 80 3.988,7.62; 81 3.505,7.62; 82 2.997,7.62; 83 2.489,7.62; 84 2.007,7.62; 85 1.499,7.62; 86 0.991,7.62; 87 0.508,7.62; 88 0,7.62; 89 -0.508,7.62; 90 -0.991,7.62; 91 -1.499,7.62; 92 -2.007,7.62; 93 -2.489,7.62; 94 -2.997,7.62; 95 -3.505,7.62; 96 -3.988,7.62; 97 -4.496,7.62; 98 -5.004,7.62; 99 -5.512,7.62; 100 -5.994,7.62
RN-52 = smd 1.2 x 0.8: 1 -6.6,8.33; 2 -6.6,7.13; 3 -6.6,5.93; 4 -6.6,4.73; 5 -6.6,3.53; 6 -6.6,2.33; 7 -6.6,1.13; 8 -6.6,-0.07; 9 -6.6,-1.27; 10 -6.6,-2.47; 11 -6.6,-3.67; 12 -6.6,-4.87; 13 -6.6,-6.07; 14 -6.6,-7.27; 15 -6.6,-8.47; 16 -6.6,-9.67; 25 6.6,-9.67; 26 6.6,-8.47; 27 6.6,-7.27; 28 6.6,-6.07; 29 6.6,-4.87; 30 6.6,-3.67; 31 6.6,-2.47; 32 6.6,-1.27; 33 6.6,-0.07; 34 6.6,1.13; 35 6.6,2.33; 36 6.6,3.53; 37 6.6,4.73; 38 6.6,5.93; 39 6.6,7.13; 40 6.6,8.33; G1 -6.6,9.53; G4 6.6,9.53 | smd 0.8 x 1.2: 17 -4.2,-11.47; 18 -3,-11.47; 19 -1.8,-11.47; 20 -0.6,-11.47; 21 0.6,-11.47; 22 1.8,-11.47; 23 3,-11.47; 24 4.2,-11.47; G2 -5.9,-11.47; G3 5.9,-11.46; RFG1 -3.5,9.03; RFG2 -2.1,9.03; RFG3 -0.7,9.03; RFG4 0.7,9.03; RFG5 2.1,9.03; RFG6 3.5,9.03
DO-214AC = smd 1.27 x 1.47: NEG 4.855,0; POS 0.635,0
UVXS0606 = smd 1 x 1: ENABLE1 -9.14,-5.33; ENABLE2 -7.11,-5.33; NC1 -9.14,1.68; NC2 -9.14,-0.66; NC3 -9.14,-3; NC4 7.11,-5.33; NC5 9.14,-5.33; PGND2 -7.11,-0.66; PGND3 -5.08,-0.66; PGND4 -3.05,-0.66; PGND5 -1.02,-0.66; PGND6 1.02,-0.66; PGND7 3.05,-0.66; PGND8 5.08,-0.66; PGOOD1 7.11,-3; PGOOD2 -7.11,-3; SIG_GND 9.14,-0.66; SYNC 7.11,-0.66; TRIM1 9.14,-3; TRIM2 9.14,1.68; VSNS1 9.14,4.01; VSNS2 -9.14,4.01 | smd 5.08 x 3.05: PGND1 0,3.05 | smd 4.32 x 3.05: PGND9 -0.36,-4.32 | smd 2.79 x 2.29: VIN -4.49,-4.7; VIN2 4.03,-4.7 | smd 4.57 x 2.29: VOUT1 5.59,3.43; VOUT2 -5.59,3.43
SMA90_DIP = drill 1.5 pad 2.54: ANTENNA 0,0 | drill 1.6 pad 2.54: GND1 -2.54,2.54; GND2 2.54,2.54; GND3 -2.54,-2.54; GND4 2.54,-2.54

### Placement (x,y rotation side)
12V  10.57,59.13 0 top
AM_ANT  13.07,7.96 180 top
ANT  20.35,3.04 180 top
APXK004A0X  26.62,54.66 180 top
C1  32.11,14.29 180 top
C2  32.11,12.69 180 top
C3  19.08,8.07 0 top
C4  29.71,9.49 90 top
C5  21.38,9.3 90 top
C6  24.37,11.21 180 top
C7  32.11,6.69 180 top
C8  25.97,13.41 90 top
C9  32.11,5.09 180 top
C10  24.67,13.41 90 top
C11  23.37,13.41 90 top
C12  23.77,16.26 270 top
C13  25.17,19.81 0 top
C14  25.91,21.13 0 top
C15  23.57,22.56 90 top
C16  25.28,16.8 270 top
C17  12.69,18.71 180 top
C18  12.4,21.34 180 top
C19  12.69,20.01 180 top
C20  14.43,22.45 270 top
C21  13,23.37 270 top
C22  11.68,23.37 270 top
C23  18.39,24.38 90 top
C24  17.07,23.88 90 top
C25  15.75,22.45 90 top
C26  7.82,11.48 0 top
C27  26.35,10.54 270 top
C28  9.43,23.45 180 top
C29  37.29,32.82 0 top
C30  36.17,34.24 0 top
C31  69.19,54.36 90 top
C32  71.73,51.71 180 top
C33  71.63,49.07 180 top
C34  71.63,47.65 180 top
C35  71.63,46.23 180 top
C36  71.63,44.81 180 top
C37  71.63,43.38 180 top
C38  71.63,41.96 180 top
C39  71.63,40.54 180 top
C40  57.91,35.66 90 top
C41  71.63,38.61 0 top
C42  71.73,36.68 180 top
C43  55.27,41.05 90 top
C44  56.79,41.05 90 top
C45  56.39,47.04 0 top
C46  56.39,48.56 0 top
C47  56.39,45.52 0 top
C48  56.39,50.09 0 top
C49  56.39,51.92 0 top
C50  24.79,42.47 180 top
C51  18.59,42.47 180 top
C52  45.62,16.56 180 top
C53  45.62,15.24 180 top
C54  33.63,57.51 0 top
C56  2.03,28.04 90 top
C57  11.38,41.05 180 top
C58  3.66,28.04 270 top
C59  16.36,41.66 90 top
D1  18.08,6.57 90 top
D2  29.36,53.54 180 top
D3  18.69,41.05 180 top
D4  7.52,23.27 270 top
FLASH  10.06,14.63 90 top
FLASH_ISP  2.64,14.73 0 top
FRONT  64.62,58.62 180 top
GND  3.64,58.48 0 top
GND47  3.35,22.76 0 top
H1  76.71,31.6 0 top
H2  3.56,4.47 0 top
H4  76.54,4.47 0 top
IC1  32.31,9.69 180 top
IC2  17.97,17.11 90 top
IN2  77.52,45.11 270 top
IN4  77.01,52.43 270 top
ISP  30.99,47.75 180 top
L1  20.27,9.71 90 top
L2  21.17,11.81 270 top
L3  20.27,11.81 270 top
MIC  63.2,27.33 180 top
MIX  73.66,58.42 0 top
PCM  30.07,26.31 0 top
PIHEADER  24.08,57.71 0 top
Q1  44.5,30.68 90 top
Q2  3.15,34.14 180 top
Q3  1.93,31.9 0 top
Q4  38.61,37.08 90 top
R1  51.51,42.57 270 top
R2  49.78,40.34 0 top
R3  13.11,55.88 180 top
R4  15.54,58.62 90 top
R5  54.15,1.73 180 top
R6  54.46,3.15 180 top
R7  53.64,5.99 180 top
R8  54.46,4.57 180 top
R9  72.64,16.46 0 top
R10  36.17,5.79 270 top
R11  72.64,17.88 0 top
R12  39.22,34.24 180 top
R13  37.19,16.56 90 top
R14  21.64,42.47 0 top
R15  4.78,32.11 270 top
R16  9.65,42.47 0 top
R17  12.8,42.47 0 top
R18  28.75,34.04 90 top
R19  27.13,35.97 90 top
R20  26.92,30.78 90 top
R21  8.33,41.05 0 top
R22  9.86,27.74 0 top
R23  38.71,16.66 90 top
R24  40.74,16.66 90 top
R25  72.64,20.83 180 top
R26  72.64,19.41 180 top
R27  46.33,1.32 0 top
R28  8.64,8.94 90 top
R29  10.06,8.94 270 top
REAR  56.69,58.52 180 top
RTC  45.31,35.86 270 top
SJ1  8.23,19.1 270 top
SUB  68.68,58.42 0 top
TDA  64.31,44.7 270 top
U5  42.37,9.14 0 top
U6  43.08,50.5 0 top
U$1  63.4,10.57 180 top
U$2  3.35,49.28 90 top
U$3  3.25,49.07 270 top
U$4  16.15,34.95 0 top
X1  49.28,21.34 0 top
X2  28.09,17.01 0 top

### Tracks (layer width: path | path; a pad name or v marks a point on that pad's centre or on a via)
3V3  (via drill 0.33, 0.6, 0.7)
  Top 0.152: IC1.3 31.56,10.54 31.56,9.91 31.88,9.59 32.51,9.59 33.15,10.22 33.15,10.54 IC1.1 | 44.77,14.36 U5.36 44.86,14.13 C53.2 | R2.2 51.51,41.21 R1.2 | 36.83,12.34 34.14,15.04 v34.14,15.95 35.6,17.41 R13.2 | U$1.20 64.06,22.12 65.01,22.12 U$1.19 | D4.A 8.23,24.98 8.23,26.42
  Top 0.305: 36.83,12.34 U5.2 38.15,12.34 38.91,13.11 44.5,13.11 44.7,13.31 44.7,13.98 U5.36 | 34.24,16.05 v34.14,15.95 | v45.62,39.22 v49.99,39.22 50.63,39.86 R2.2 | v66.45,24.69 65.2,23.44 U$1.19 | v19.61,47.45 17.73,49.33 PIHEADER.1
  Top 0.406: C58.2 7.45,27.09 8.13,26.42 8.23,26.42 24.79,26.42 26.92,28.55 29.06,28.55 30.07,29.57 v30.07,36.98 v26.52,40.54
  Bottom 0.152: 34.14,22.05 34.14,22.25
  Bottom 0.305: v45.62,39.22 35.25,39.22 | v49.99,39.22 50.9,39.22 60.25,29.87 65.02,29.87 67.67,27.23 67.67,25.91 v66.45,24.69 | 17.68,57.91 PIHEADER.1 | v26.52,40.54 v19.61,47.45
  Bottom 0.406: v34.14,15.95 34.14,22.25 34.14,34.95 32.31,36.78 30.28,36.78 v30.07,36.98 | 35.25,39.22 27.84,39.22 v26.52,40.54
  pour Top: 32.31,15.98 32.21,10.39 32.71,9.99 34.11,9.99 34.51,10.39 34.51,15.88 34.12,16.58 32.91,16.48
3V3-PRE  (via drill 0.33, 0.6)
  Top 0.305: 21.64,38.28 21.64,35.97 20.83,35.15 9.65,35.15 v9.25,35.56 | Q3.1 0.68,30.35 C56.2 | D3.A 19.69,40.43 21.1,39.03 | v7.31,28.04 4.58,28.04 C58.1
  Top 0.406: C56.2 3.63,28.99 C58.1
  Top 0.813: 21.1,39.03 U$4.VOUT1 | U$4.VOUT1 24.71,38.38 U$4.VSNS1 | 21.64,38.28 U$4.VOUT1
  Bottom 0.305: v9.25,35.56 9.25,29.97 v7.31,28.04
3V3CONST  (via drill 0.33)
  Top 0.152: U5.18 43.18,4.23 v43.18,3.15 | v46.43,37.69 48.04,37.69 RTC.8
  Top 0.305: 15.18,42.61 arc90 v15.14,42.57 | v27.23,54.76 27.51,54.48 D2.A
  Top 0.813: C59.2 15.18,42.61 v15.14,42.57
  Bottom 0.152: v46.43,37.69 46.13,37.69 45.11,38.71 33.83,38.71 32.56,37.54
  Bottom 0.305: v27.23,54.76 20.73,48.26 19.3,48.26 15.14,44.09 v15.14,42.57
  Bottom 0.406: v15.14,42.57 15.24,42.47 23.57,42.47 28.14,37.9 32.21,37.9 32.56,37.54 35.36,34.75 35.36,10.97 v43.18,3.15
3VSCL  (via drill 0.33)
  Top 0.152: U6.44 46.02,42.82 46.02,41.86 46.43,41.45 v47.95,41.45 48.77,41.45 48.97,41.66 49.28,41.66 51.04,43.42 R1.1 | 48.67,35.26 48.87,35.26 50.19,36.58 50.19,38.2 51.82,39.83 v51.82,40.54 | 48.67,35.26 48.14,35.26 RTC.6 | 59.82,43.38 TDA.22 59.75,43.42 R1.1 | 51.5,43.43 R1.1 | 48.67,35.26 49.17,34.75 49.17,31.6 40.33,22.76 v27.84,22.76 | IC2.30 18.22,21.47 v18.49,21.74
  Bottom 0.152: v47.95,41.45 48.87,40.54 v51.82,40.54 | v18.49,21.74 26.82,21.74 v27.84,22.76
3VSDA  (via drill 0.33)
  Top 0.152: TDA.23 58.52,42.16 57.61,43.08 52.63,43.08 52.12,42.57 51,42.57 50.6,42.27 50.6,41.66 50.29,41.35 49.17,41.35 48.97,41.15 48.97,40.37 R2.1 48.83,40.44 46.13,40.44 45.52,41.05 45.52,41.86 | 45.52,41.86 45.52,42.82 U6.43 | 47.93,33.74 RTC.5 | RTC.5 47.22,33.96 46.02,35.15 46.02,37.29 45.01,38.3 45.01,41.35 45.52,41.86 | RTC.5 48.06,33.9 48.06,31.19 40.33,23.47 v26.42,23.47 | IC2.31 17.68,20.65 17.68,21.64 v17.58,21.74
  Bottom 0.152: v26.42,23.47 25.3,22.35 18.19,22.35 v17.58,21.74
9V  (via drill 0.33)
  Top 0.152: v53.39,38.52 53.49,38.42
  Top 0.305: C44.1 57.49,40.89 TDA.24 | v35.36,43.59 34.24,42.47 C50.1
  Top 0.406: 53.38,38.3 53.49,38.42 C43.1
  Top 1.016: 55.15,40.08 C43.1 C44.1
  Bottom 0.305: v53.39,38.52 54.05,39.18 54.05,42.67 53.75,42.98 50.8,42.98 48.77,45.01 42.87,45.01 41.45,43.59 v35.36,43.59
12V  (via drill 0.33, 0.6)
  Top 0.305: Q3.2 3.23,30.8 v3.96,30.07
  Top 0.813: 10.77,33.06 19.27,33.06 20.12,32.21 20.12,30.32 U$4.VIN2 | U$4.VIN 11.66,32.16 10.77,33.06 | 5.18,33.36 5.18,36.37 3.05,38.51 v3.05,42.37 3.05,44.01 U$3.NEG 7.82,48.79 APXK004A0X.VIN | 5.18,33.36 R15.1 | 10.77,33.06 6.97,33.06 v6.91,33.12 5.42,33.12 5.18,33.36
  Bottom 0.305: v6.91,33.12 6.91,30.38 5.89,29.36 4.67,29.36 v3.96,30.07
  Bottom 0.813: 12V.1 8.05,50.62 2.95,45.52 2.95,42.47 v3.05,42.37
12VACC
  Top 0.305: 12V.3 13.11,56.73 R3.2
  Top 0.61: U$2.NEG 4.19,54.97 10.16,54.97 11.07,55.88 R3.2
+1V8  (via drill 0.33, 0.5, 0.6, 0.7)
  Top 0.152: C27.1 26.35,12.26 C8.1 C10.1 C11.1 23.32,12.64 22.33,13.64 20.75,13.64 IC2.12 | IC2.5 17.22,13.97 17.58,14.33 20.42,14.33 20.73,14.02 IC2.12 | IC2.12 | IC2.34 16.22,21.22 C25.1
  Top 0.305: C27.1 26.26,11.21 C6.1 | C19.1 13.16,20.3 C18.1 | C19.1 C17.1 13.32,18.71 12.39,17.78 11.48,17.78 10.97,18.29 10.97,20.42 10.16,21.23 v10.16,22.15 10.16,23.41 C28.1 11,23.45 C22.1 11.73,24.08 13.11,24.08 13.06,24.13 C21.1 13.51,24.13 C20.1 | C19.1 13.61,19.86 IC2.37 15.49,19.86 15.75,20.12 15.75,20.58 IC2.35
  Top 0.406: v19.71,24.89 18.44,23.62 C23.1 17.88,23.11 C24.1 15.75,21.79 C25.1
  Top 0.61: v27.55,10.9 27.55,4.66 29.77,2.44 32.82,2.44 33.93,3.56 33.93,4.88 v34.14,5.08
  Top 0.813: C27.1 26.37,11.28
  Top 1.016: 26.37,11.28 27.18,11.28 v27.55,10.9
  Bottom 0.152: 27.13,14.07 27.04,14.07 26.85,13.71
  Bottom 0.305: 34.24,7.21 v34.14,7.11
  Bottom 0.406: v10.16,22.15 15.14,22.15 | 15.14,22.15 16.66,20.62 25.2,20.62 v26.82,19 27.13,18.69 27.13,14.07 27.13,13.41 27.23,13.31 | v19.71,24.89 18.95,24.89 16.2,22.15 15.14,22.15
  Bottom 1.27: 26.85,13.71 27.55,13 v27.55,10.91 v27.55,10.9
  other vias: 27.55,11.9 34.14,6.1
  pour Top (isolate 0.2): 28.15,11.99 28.25,11 28.25,10.2 27.03,10.2 27.03,10.67 26.98,11.01 26.98,11.4 27.05,11.7 27.05,12.69 28.05,12.69
  pour Top: 32.21,8.99 32.31,4.27 34.83,4.31 34.51,9.09 34.01,9.59 32.91,9.59
ACC_READ
  Top 0.305: U6.96 39.09,59.66 38.3,60.45 16.52,60.45 R4.2 13.96,57.88 R3.1
ACINL
  Top 0.305: C41.2 71.56,37.69 69.8,37.69 69.54,38.35 TDA.3
ACINR
  Top 0.305: C42.2 70.27,37.08 TDA.2
ACOUTL
  Top 0.305: C41.1 70.17,39.62 TDA.4
ACOUTR
  Top 0.305: C42.1 71.51,35.81 TDA.1
AGND  (via drill 0.33)
  Top 0.152: U5.22 47.18,3.43 R27.2 47.38,0.91 v49.99,0.91
  Top 0.305: U5.21 U5.22 46.33,4.28 46.33,5.38 | U5.33 47.48,13.14 | U5.33 46.57,13.14 46.33,12.9 46.33,11.07 | 46.33,11.07 46.33,9.55 | 46.33,9.55 46.33,8.84 | 46.33,8.84 46.33,7.82 | 46.33,7.82 46.33,6.2 | 46.33,6.2 46.33,5.38 | U5.24 46.89,5.94 46.33,5.38 | U5.25 46.88,6.74 46.33,6.2 | U5.27 46.85,8.34 46.33,7.82 | U5.29 46.72,9.94 46.33,9.55 | U5.28 46.63,9.14 46.33,8.84 | U5.31 46.8,11.54 46.33,11.07 | U5.33 47.69,13.14 48.67,14.12 48.67,16.87 X1.GND3
  Bottom 0.305: X1.GND3 X1.GND4 X1.GND2 X1.GND1 X1.GND3
AMLOOPN
  Top 0.152: IC2.6 17.72,12.64 15.75,10.67 12.6,10.67 11.89,9.96 11.89,7.79 AM_ANT.2
AMLOOPP
  Top 0.152: IC2.7 18.19,13.57 18.19,12.4 16.05,10.26 14.83,10.26 14.33,9.75 14.33,7.72 AM_ANT.1
AT_POWER  (via drill 0.33)
  Top 0.305: 37.39,52.02 35.48,52.02 U6.10 35.43,52.02 v30.48,52.02 | 37.39,52.02 38.1,51.31 38.1,45.52 39.57,44.04 U6.31 | 37.39,52.02 36.58,52.83 36.58,56.59 37.08,57.1 | U6.100 37.08,57.1 | U6.80 47.07,57.28 47.29,57.05 | 47.29,57.05 47.55,56.79 47.55,50.5 48.54,49.5 U6.61 | D2.C 31.21,52.75 v30.48,52.02 | 37.08,57.1 38.2,55.98 46.53,55.98 47.29,56.74 47.29,57.05 | ISP.2 29.57,45.21 28.45,46.33 28.45,51.21 29.26,52.02 v30.48,52.02
BLUETOOTH-CTS
  Top 0.152: U$1.14 71.75,17.84 R11.1
BLUETOOTH-RTS
  Top 0.152: U$1.13 71.62,16.64 R9.1
BLUETOOTH_AUDIO_L
  Top 0.152: C37.1 74.37,43.38 74.78,42.98 74.78,36.78 72.24,34.24 64.82,34.24 55.27,24.69 55.27,9.96 52.79,7.48 R7.2
  Top 0.406: R7.2 51.61,5.99 50.9,5.18 50.9,2.24 51.71,1.73 R5.2
BLUETOOTH_AUDIO_R
  Top 0.152: C36.1 74.27,44.81 75.08,43.99 75.08,36.58 72.34,33.83 65.02,33.83 55.68,24.49 55.68,9.65 53.64,7.62 53.64,4.61 R8.2
  Top 0.406: R6.2 R8.2
BLUETOOTH_RX
  Top 0.152: U$1.16 71.2,20.24 R25.2
BLUETOOTH_TX
  Top 0.152: U$1.15 71.42,19.04 R26.2
COMMAND_SWITCH  (via drill 0.33)
  Top 0.152: U6.51 50.9,44.3 v52.63,44.3 | v71.42,13 71.39,13.04 U$1.10
  Bottom 0.152: v71.42,13 71.42,14.94 70.92,15.44 70.92,24.59 65.13,30.38 60.35,30.38 54.66,36.07 54.66,42.98 53.34,44.3 v52.63,44.3
CREF
  Top 0.152: C31.1 69.19,52.65 TDA.14
DIFFG
  Top 0.305: TDA.12 69.27,50.19 73.56,50.19 75.79,52.43 77.22,52.43 IN4.2
DIFFL
  Top 0.305: TDA.11 70.12,48.51 C33.2
DIFFR
  Top 0.305: C32.2 70.12,51.05 TDA.13
ENABLE  (via drill 0.33)
  Top 0.152: APXK004A0X.ON/OFF 25.3,53.09 25.3,47.96 24.18,46.84 7.62,46.84 v6.3,45.52 | 5.28,30.17 v5.18,30.07
  Top 0.305: Q2.3 3.6,32.53 R15.2 4.84,31.19 | U$4.ENABLE1 7.01,30.07 5.89,31.19 4.84,31.19 | 4.84,31.19 4.84,30.42 v5.18,30.07
  Bottom 0.152: v5.18,30.07 5.18,37.08 7.62,39.52 7.62,44.2 v6.3,45.52 6.6,45.21
FLASH_CE  (via drill 0.33)
  Top 0.152: 15.14,13.52 IC2.1 v14.33,12.7 12.68,12.7 FLASH.1
  Bottom 0.152: v14.33,12.7 13.72,13.31 2.74,13.31 1.63,12.19 FLASH_ISP.5
FLASH_SCK  (via drill 0.33)
  Top 0.152: 15.75,13.63 IC2.2 15.72,12.78 15.04,12.09 9.96,12.09 9.45,12.6 v9.45,14.02 9.45,14.53 8.74,15.24 7.48,15.24 FLASH.6
  Bottom 0.152: FLASH_ISP.3 1.83,14.73 2.95,13.61 9.04,13.61 v9.45,14.02
FLASH_SI  (via drill 0.33)
  Top 0.152: FLASH.5 8.86,16.54 9.96,15.44 v9.96,15.04 9.96,14.33 10.87,13.41 14.12,13.41 14.73,14.02 14.73,14.31 IC2.48
  Bottom 0.152: FLASH_ISP.4 9.65,14.73 v9.96,15.04
FLASH_SO  (via drill 0.33)
  Top 0.152: IC2.47 14.04,14.86 13.18,14 FLASH.2 12.58,13.92 11.38,13.92 11.07,14.22 v11.07,14.53
  Bottom 0.152: v11.07,14.53 11.07,15.14 10.06,16.15 2.49,16.15 FLASH_ISP.1
FLASH_VIN
  Top 0.152: 7.21,18.29 7.01,18.49 7.01,20.52 7.52,21.03 D4.C | 7.21,18.29 8.15,18.29 SJ1.3 | FLASH_ISP.2 5.28,17.27 | 7.21,18.29 6.2,17.27 5.28,17.27 | 5.28,17.27 4.98,16.97 4.98,14.63 5.61,14 FLASH.7 FLASH.8 6.9,11.84 C26.1
GND  (via drill 0.33, 0.33 pad 0.3, 0.38, 0.5, 0.6, 0.7, 0.8)  (2 unrouted)
  Top 0.152: 29.16,12.64 v30.74,15.53 | v13.37,17.51 13.37,17.25 FLASH.4 12.53,16.66 10.97,16.66 10.46,17.17 10.46,19.41 9.88,19.99 SJ1.1 | 19.2,13.63 IC2.9 | C12.1 23.37,16.7 23.37,17.5 v24.58,18.78 24.57,18.05 C16.1 25.54,18.01 26.63,18.01 X2.4 | 29.66,10.3 C4.2 | C44.2 C43.2 | C43.2 55.21,41.96 | IC2.32 17.22,20.17 17.47,19.91 18.49,19.91 18.69,20.12 18.69,20.58 IC2.29 18.72,21.16 19.41,21.84 19.41,22.25 v20.22,23.06 | C15.2 22.71,23.32 v22.55,23.16 | R7.1 54.49,5.38 R8.1 | C13.2 26.72,20.59 26.72,21.06 C14.2 | C26.2 8.62,11.21 8.27,11.21 v6.6,8.64 | U6.11 35.51,51.54 35.51,51.51 | C43.2 54.98,41.69 52.76,39.47 52.76,38.2 53.39,37.57 57.84,37.57 v58.01,37.8 | IC2.EP 18.15,17.25 v17.95,17.08 | U5.10 U5.11 | U5.11 35.76,5.14 R10.2 | U5.11 37.53,5.08 40.54,5.08 | 40.54,5.08 43.79,5.08 43.97,4.9 U5.19 | U5.15 40.77,4.85 40.54,5.08 | Q4.2 39.95,37.8 v40.64,37.8 | v47.65,16.26 46.94,15.24 C53.1 C52.1
  Top 0.204: C2.2 31.31,11.89 31.91,11.89 IC1.2
  Top 0.254: IC2.39 IC2.40 IC2.41 IC2.42 14.32,17.51 v13.37,17.51 | L2.1 21.22,12.31 | C6.2 23.57,11.17 v23.93,9.96 | v24.58,18.78 24.91,18.78 C13.2 | 35.46,51.51 35.51,51.51 37.19,51.51 37.19,51.31
  Top 0.305: RTC.3 RTC.4 | 8.51,23.6 C28.2 8.67,20.43 SJ1.1 | U$1.G4 59.4,1.04 arc90 U$1.RFG6 59.9,3.3 58.62,4.57 56.86,4.57 U$1.38 | TDA.15 59.16,52.93 v58.22,52.93 | TDA.27 58.93,37.08 58.22,37.8 v58.01,37.8 | C31.2 69.25,55.27 v70.51,54.97 | v10.77,25.3 10.36,25.3 8.64,23.57 | v61.67,37.08 59.84,37.08 59.84,36.98 | U6.99 37.57,59.06 37.39,59.23 35.86,59.23 v35.76,58.72 33.92,58.72 C54.1 | v40.74,2.54 40.74,4.17 | 43.99,4.27 43.99,2.84 v44.2,2.54 | 35.66,4.78 35.76,4.78 38.1,2.44 | 46.13,59.84 46.63,59.33 | FLASH_ISP.6 6.4,9.7 v6.6,8.64 | R8.1 56.73,4.57 U$1.38 | U$1.38 U$1.37 U$1.36 U$1.35 U$1.34 | 25.5,1.12 v25.3,1.32 R27.1 47.24,1.32 | U6.11 30.91,51.49 ISP.6
  Top 0.406: U$1.RFG6 U$1.RFG5 U$1.RFG4 U$1.RFG3 U$1.RFG2 U$1.RFG1 | C29.1 36.36,33.12 C30.1
  Top 0.61: 26.22,9.91 C27.2 26.17,9.96 v23.93,9.96
  Top 0.813: 68.68,21.54 70.31,21.54 70.31,22.56 68.68,22.56 | X2.2 29.21,14.48 v30.13,14.7
  other vias: 22.17,11.81 22.92,7.39 19.07,17.11 19.07,18.11 19.07,16.11 17.97,18.11 17.97,16.11 16.83,17.08 16.87,18.11 23.23,6.11 23.33,5.06 23.33,4.01 17.37,5.28 17.37,4.27 19.17,11.12 19.07,12.23 17.37,3.25 22.58,10.7 22.58,9.6 22.58,8.5 16.87,16.11 30.11,13.69 30.11,12.69 30.11,11.69 30.11,7.49 30.11,6.49 30.11,5.49 29.21,7.49 14.63,50.19 15.34,52.02 15.65,53.75 11.79,52.73 13,50.7 10.77,50.19 13.92,52.12 61.26,9.75 61.26,16.36 61.26,15.14 61.26,13.82 61.26,12.5 61.26,11.07 66.04,9.75 66.14,18.9 66.14,17.58 66.14,15.04 66.14,16.36 66.14,13.82 66.14,12.5 66.14,11.18 58.22,3.45 59.44,3.45 60.66,3.45 61.87,3.45 63.09,3.45 64.41,3.45 65.63,3.45 66.85,3.45 68.07,3.45 40.64,45.11 37.08,50.7 36.98,49.38 37.08,47.96 37.08,46.53 35.76,41.35 35.66,42.57 19.2,10.26 17.07,6.2 17.37,2.13 23.37,2.84 23.37,1.63 52.83,42.27 52.83,41.35 52.83,40.44 52.83,39.52 50.9,37.69 50.9,36.78 50.9,35.86 51.1,34.95 51.61,34.24 41.96,32.21 41.15,32.21 40.23,32.21 26.06,8.7 26.06,7.69 26.06,6.67 26.06,5.66 26.17,4.64 38.1,2.54 39.42,2.54 45.82,2.74 49.17,4.88 49.17,6.71 48.87,8.53 48.67,10.46 49.58,11.38 1.63,36.98 1.32,38.4 4.67,42.16 1.22,39.83 1.22,41.25 6.1,42.16 52.53,50.6 52.53,51.82 52.53,53.14 52.53,54.36 52.53,55.58 13.61,27.84 15.04,27.74 19.51,27.64 20.93,27.64 22.25,27.64 11.48,51.41 5.18,52.02 9.35,50.39 9.96,51.61 9.25,43.79 10.16,43.79 28.75,40.94 30.18,41.05 34.54,41.05 39.73,45.92 39.32,47.14 39.32,48.46 39.22,49.68 39.12,50.9 38.81,52.12 38,53.14 41.76,45.82 42.98,46.23 44.3,46.13 45.62,46.13 46.84,46.13 48.16,46.13 48.06,47.35 47.65,48.56 46.94,49.58 46.53,50.8 46.53,52.02 46.53,53.34 66.34,35.26 36.58,37.19 36.58,38.1 5.89,18.19 6.1,19.3 8.84,22.05
  pour Top (isolate 0.2): 16.52,1.31 16.67,11.61 19.07,14.31 21.17,14.31 22.67,12.81 22.67,9.61 23.68,8.7 23.75,1.31
  pour Top: 31.11,16.39 30.11,16.39 28.81,14.49 28.75,7.01 29.67,3.56 31.21,3.38 31.81,4.09 31.81,15.39
  pour Top (isolate 0.305): 0.1,59.33 33.43,59.94 33.02,51.82 28.45,51.31 28.35,43.59 33.32,43.69 33.43,26.52 -0.2,26.31
  pour Bottom (isolate 0.254): -0.2,59.44 31.6,59.84 27.64,52.53 27.64,43.79 34.14,43.89 31.39,26.52 0.1,26.92
  pour Bottom (isolate 0.254): 29.77,0.41 4.78,0.41 4.78,23.67 28.45,23.37 28.35,16.87 28.35,16.56 34.95,16.56 34.95,4.27 29.67,4.37
  pour Bottom (isolate 0.254): 53.85,59.44 54.25,33.93 66.14,34.65 80.57,34.54 80.67,38.81 80.16,59.33
  pour Top (isolate 0.254): 80.37,35.36 72.54,35.15 72.24,23.57 55.68,23.57 55.27,0 77.42,0.1 80.67,0.41 80.57,31.19
  pour Top (isolate 0.254): 34.14,59.64 53.14,59.64 53.14,39.73 34.24,39.42
  pour Bottom (isolate 0.305): 35.36,31.29 35.26,36.37 53.54,37.08 53.44,31.29
  pour Bottom: 36.37,18.39 50.29,18.08 50.7,0.61 36.58,0.41
  pour Bottom: 35.56,59.64 53.24,59.03 53.85,37.08 34.95,36.58
  pour Bottom: 30.68,59.74 39.42,59.54 38.91,57 30.78,57.1
  pour Bottom: 5.08,22.45 5.08,28.65 14.43,28.65 14.43,22.45
  pour Bottom: 32,12.7 38.2,12.7 38.2,10.36 32,10.36
  pour Bottom: 27.64,12.7 33.83,12.7 33.83,10.36 27.64,10.36
  pour Bottom: 32,12.7 38.2,12.7 38.2,10.36 32,10.36
  pour Bottom: 24.99,4.27 38.61,4.37 38.61,2.03 24.99,1.93
  pour Bottom: 32.51,4.37 38.71,4.37 38.71,0.41 29.16,0.51
  pour Bottom: 71.02,22.25 71.02,35.97 79.96,36.17 80.37,22.45
  pour Bottom: 55.27,50.09 49.07,50.09 49.07,52.43 55.27,52.43
  pour Bottom: 30.18,42.47 36.37,42.47 36.37,40.13 30.18,40.13
  pour Bottom: 55.98,23.77 80.57,23.77 80.57,0.3 55.98,0.3
  pour Bottom: 60.55,2.74 46.84,2.74 46.94,9.25 60.66,9.25
  pour Top: 53.54,31.19 36.07,31.19 36.07,43.79 53.54,43.79
  pour Top: 3.25,25.1 26.42,25.1 26.42,1.32 3.25,1.32
GPS-RX
  Top 0.152: U5.42 39.97,15.04 R24.1
GPS-TX
  Top 0.152: U5.44 38.37,15.47 R23.1
INT  (via drill 0.33)
  Top 0.152: R28.2 8.64,9.86 9.45,10.67 11.58,10.67 12.29,11.38 15.24,11.38 15.75,11.89 v15.75,11.99 16.22,12.46 IC2.3 16.26,13.57 | v33.43,20.73 v36.98,20.73 | v43.38,40.54 43.69,40.84 43.69,41.35 43.99,41.66 44.3,41.66 44.58,41.94 U6.41
  Bottom 0.152: v15.75,11.99 15.75,12.5 16.56,13.31 17.47,13.31 18.49,14.33 24.99,14.33 26.62,12.7 26.62,10.46 27.13,9.96 28.04,9.96 28.45,10.36 28.45,17.88 31.29,20.73 v33.43,20.73 | v43.38,40.54 43.89,40.03 45.72,40.03 47.04,38.71 47.04,30.18 37.59,20.73 v36.98,20.73
MIC_L  (via drill 0.33)
  Top 0.152: U$1.32 57.76,11.84 58.11,12.19 58.11,18.19 59.03,19.1 v59.23,19.1
  Bottom 0.152: MIC.2 60.15,25.3 60.15,19.81 59.44,19.1 v59.23,19.1
MIC_R  (via drill 0.33)
  Top 0.152: U$1.33 57.88,10.64 58.42,11.18 58.42,17.27 v60.15,19
  Bottom 0.152: MIC.1 62.48,25.1 61.57,25.1 60.55,24.08 60.55,19.61 60.15,19.2 v60.15,19
MIX
  Top 0.305: TDA.28 58.41,35.81 C40.2
N$1
  Top 0.254: L1.1 20.27,8.31 C3.2
N$2
  Top 0.152: IC2.10 19.72,11.81 L3.2
  Top 0.254: L3.2 L2.2 21.17,10.45 C5.2 L1.2
N$3
  Top 0.254: L3.1 20.22,12.41 IC2.11
N$4
  Top 0.254: IC2.13 21.66,14.17 C11.2 C10.2 C8.2
N$5
  Top 0.305: 11.93,22.45 C22.2 | C22.2 C21.2 13.51,22.61 C20.2 | C20.2 14.43,21.89 C25.2 17.07,24.54 C24.2 17.58,25.15 C23.2 | C19.2 11.63,20.3 C18.2 11.68,21.39 C22.2 | C20.2 15.22,20.9 IC2.36
  Top 0.61: C19.2 C17.2
N$6
  Top 0.152: IC2.15 23.31,15.36 C12.2 24.01,15.41 24.49,14.94 26.31,14.94 26.72,15.34 26.72,16.2 X2.1
N$7
  Top 0.152: IC2.16 22.36,15.86 22.76,16.26 24.98,16.26 C16.2 25.08,16.04 25.49,16.04 25.49,16.34 26.11,16.97 28.42,16.97 29.24,17.78 X2.3
N$8
  Top 0.152: IC2.17 22.37,16.36 22.37,16.68 22.96,17.27 22.96,17.99 23.88,18.91 23.88,19.51 24.17,19.81 C13.1
N$10  (via drill 0.33)
  Top 0.152: U6.59 49.91,48.49 v49.28,47.85 | R9.2 75.59,16.46 v75.79,16.66
  Bottom 0.152: v75.79,16.66 72.75,16.66 71.32,18.08 71.32,24.69 65.23,30.78 60.45,30.78 55.07,36.17 55.07,43.08 50.39,47.75 49.38,47.75 v49.28,47.85
N$11
  Top 0.406: C4.1 31.17,8.72 IC1.4
N$12  (via drill 0.33)
  Top 0.152: U6.60 49.61,49 v49.38,48.77 | R11.2 75.69,17.88 v75.79,17.98
  Bottom 0.152: v75.79,17.98 72.24,17.98 71.73,18.49 71.73,24.79 65.43,31.09 60.65,31.09 55.47,36.27 55.47,43.18 49.99,48.67 49.48,48.67 v49.38,48.77
N$13
  Top 0.152: U6.33 40.54,42.82 40.54,41.66 39.52,40.64 38.71,40.64 37.71,39.64 Q4.3 37.71,38.19 38.61,37.29 38.61,34.48 R12.2 C30.2
N$14
  Top 0.152: FLASH.3 11.97,15.95 10.46,15.95 9.96,16.46 9.96,18.29 9.25,19 8.33,19 SJ1.2
N$15
  Top 0.152: R5.1 55.17,1.8 56.76,1.8 56.76,2.12 U$1.40
N$16
  Top 0.305: R6.1 55.59,3.44 U$1.39
N$17
  Top 0.813: R17.2 15.68,44.5 APXK004A0X.TRIM 17.64,43.57 C51.2
N$18
  Top 0.152: MIX.1 72.54,58.83 72.54,57.1 71.83,56.39 68.58,56.39 67.26,55.07 67.26,43.08 65.02,40.84 65.02,37.69 62.24,34.91 57.91,34.91 C40.1
N$19
  Top 0.406: Q1.2 44.5,35.86 43.87,36.5 RTC.2
N$20
  Top 0.406: RTC.1 44.73,37.77 45.52,36.98 45.52,33.12 46.33,32.31 46.33,31.24 Q1.1
N$21
  Top 0.305: C35.1 74.09,46.23 IN2.3
N$22
  Top 0.305: C34.1 77.75,47.65 IN2.1
N$23  (via drill 0.33)
  Top 0.152: R23.2 38.71,17.68 v40.74,19.71 | U6.46 47.07,44.07 v46.94,44.2
  Bottom 0.152: v46.94,44.2 47.04,44.09 47.04,40.44 48.16,39.32 48.16,29.46 40.74,22.05 v40.74,19.71
N$24
  Top 0.152: C29.2 38.64,32.82 R12.1 39.51,34.8 Q4.1 39.79,35.93 41.35,37.49 41.35,41.35 41.05,41.66 41.05,42.85 U6.34
N$25
  Top 0.305: C33.1 76.43,49.07 IN4.3
N$26
  Top 0.305: C32.1 75.88,54.94 IN4.1
N$28  (via drill 0.33)
  Top 0.152: R24.2 v40.74,18.8 | U6.45 46.58,43.64 v46.02,44.2
  Bottom 0.152: v40.74,18.8 40.13,19.41 40.13,22.05 47.85,29.77 47.85,39.01 46.13,40.74 46.13,44.09 v46.02,44.2
N$29
  Top 0.813: R16.2 R17.1
N$30
  Top 0.152: U5.9 35.66,6.74 R10.1
N$31
  Top 0.152: R13.1 38.14,16.66 41.96,16.66 42.06,16.56 C52.2
  Top 0.406: U5.1 37.47,15.43 R13.1
N$32
  Top 0.152: C48.1 55.07,50.09 54.56,50.6 54.56,52.83 56.39,54.66 64.01,54.66 64.62,55.27 FRONT.1
N$33  (via drill 0.33)
  Top 0.152: C47.1 54.25,45.52 53.54,46.23 53.54,54.05 v54.56,55.07 | v60.15,55.58 60.15,58.01 FRONT.3
  Bottom 0.152: v54.56,55.07 59.64,55.07 v60.15,55.58
N$34
  Top 0.152: C46.1 54.76,48.56 54.25,49.07 54.25,53.04 55.57,54.36 55.57,57.4 REAR.1
N$35
  Top 0.152: C45.1 55.27,47.04 53.85,48.46 53.85,53.34 55.27,54.76 55.27,55.47 54.15,56.59 53.54,56.59 REAR.3
N$36
  Top 0.152: C49.1 55.54,52.9 56.9,54.25 65.84,54.25 67.41,55.83 SUB.1
N$37
  Top 0.813: APXK004A0X.VOUT 22.49,42.79 R14.2 C50.2 23.84,43.24 APXK004A0X.VS+
N$38
  Top 0.813: C51.1 R14.1
N$45  (via drill 0.33)
  Top 0.305: v28.65,36.58 27.37,36.58 R19.2 | R21.1 7.48,43.45 v9.04,45.01
  Top 0.813: U$4.TRIM2 25.48,36.82 R19.2
  Bottom 0.305: 15.44,40.23 24.99,40.23 v28.65,36.58
  Bottom 0.406: v9.04,45.01 10.67,45.01 15.44,40.23
N$46
  Top 0.813: R18.1 27.2,31.63 R20.2 26.61,31.95 U$4.TRIM1
N$47  (via drill 0.33)
  Top 0.152: R20.1 27.67,29.93 v28.14,29.46
  Top 0.305: C56.1 3.14,26.01 v7.52,26.01
  Bottom 0.305: v28.14,29.46 25.4,26.72 8.23,26.72 v7.52,26.01
N$48
  Top 0.813: R21.2 C57.2
N$49
  Top 0.813: U$4.SIG_GND 26.3,34.29 R19.1 27.36,34.89 R18.2
N$50
  Top 0.813: U$4.VOUT2 10.89,37.9 11.89,37.9 | D3.C 17.38,40.73 C59.1 12.62,40.73 arc-90 C57.1 12.31,40.12 U$4.VOUT2 | U$4.VOUT2 7.59,38.38 U$4.VSNS2
N$51  (via drill 0.33)
  Top 0.152: v49.07,50.5 U6.63 | R25.1 73.96,20.83 v74.78,20.02
  Bottom 0.152: v49.07,50.5 55.88,43.69 55.88,36.47 60.96,31.39 65.63,31.39 72.14,24.89 72.14,21.64 73.76,20.02 v74.78,20.02
N$52  (via drill 0.33)
  Top 0.152: v49.07,51.41 49.48,51 U6.64 | R26.1 75.79,19.41 v75.89,19.51
  Bottom 0.152: v75.89,19.51 75.89,19.71 74.98,20.62 73.66,20.62 72.54,21.74 72.54,24.99 65.84,31.7 61.26,31.7 56.29,36.68 56.29,44.2 v49.07,51.41
N$53  (via drill 0.33)
  Top 0.305: U$4.ENABLE2 9.04,29.77 8.94,29.77 v8.13,30.58 | v0.81,33.02 1.91,33.02 Q3.3
  Top 0.406: R22.1 9,29.58 U$4.ENABLE2
  Bottom 0.305: v0.81,33.02 0.81,31.09 3.25,28.55 6.1,28.55 v8.13,30.58
N$54  (via drill 0.33)
  Top 0.305: U6.98 38.07,56.92 38.2,56.79 v38.61,56.79 | C54.2 34.68,57.4 v35.66,57.4
  Bottom 0.305: v35.66,57.4 36.27,56.79 v38.61,56.79
N$55
  Top 0.305: U5.32 48.41,12.34 49.28,13.21 X1.ANTENNA
OUTLF
  Top 0.305: TDA.20 59.31,45.52 C47.2
OUTLR
  Top 0.305: TDA.19 59.56,47.04 C45.2
OUTRF
  Top 0.305: TDA.17 59.46,50.09 C48.2
OUTRR
  Top 0.305: TDA.18 59.71,48.56 C46.2
OUTSW
  Top 0.305: TDA.16 58.1,51.05 C49.2
PCM_CLK
  Top 0.152: IC2.27 19.72,21.04 20.62,21.95 21.64,21.95 22.25,22.56 24.08,22.56 25.6,24.08 30.17,24.08 31.19,25.1 32.51,25.1 32.61,25.2 PCM.3
PCM_DIN
  Top 0.152: IC2.33 16.72,21.9 17.27,22.45 18.59,22.45 20.83,24.69 27.13,24.69 27.53,25.1 27.53,26.54 PCM.1
PCM_FS
  Top 0.152: IC2.28 19.22,21.15 20.52,22.45 21.03,22.45 22.96,24.38 29.57,24.38 30.07,24.89 30.07,26.52 PCM.2
PI_RX
  Top 0.305: U6.2 30.96,56.01 30.58,56.39 30.58,57.81 PIHEADER.6
PI_SENSE
  Top 0.305: U6.97 38.61,58.14 38.61,59.33 38.1,59.84 26.11,59.84 25.35,59.08 PIHEADER.4
PI_SHUTDOWN
  Top 0.305: U6.5 31.06,54.48 29.77,55.78 23.37,55.78 22.86,56.29 22.86,57.91 PIHEADER.3
PI_TX
  Top 0.305: U6.3 30.76,55.5 29.97,56.29 27.94,56.29 27.84,56.39 27.84,57.91 PIHEADER.5
PROG_MISO
  Top 0.305: U6.22 33.05,46 ISP.1
PROG_MOSI
  Top 0.305: U6.21 30.96,46.51 ISP.4
PROG_SCK
  Top 0.305: U6.20 33.02,46.99 ISP.3
RELAYC+  (via drill 0.33)
  Top 0.152: v3.56,36.68 3.56,34.77 Q2.1 | U6.25 33.43,44.5 32.71,43.79 v27.13,43.79 | v5.89,43.89 5.89,44.2 8.23,46.53 24.79,46.53 v25.7,47.45
  Bottom 0.152: v5.89,43.89 6.2,43.89 7.11,42.98 7.11,39.73 4.06,36.68 v3.56,36.68 | v27.13,43.79 26.01,44.91 26.01,47.14 v25.7,47.45
RESET  (via drill 0.33)
  Top 0.305: v37.69,44.6 38.2,44.6 39.09,43.71 U6.30
  Bottom 0.305: 35.15,47.85 32.71,50.29 ISP.5
  Bottom 0.406: 35.15,47.85 35.15,46.23 36.78,44.6 v37.69,44.6
RF_IN
  Top 0.152: 19.19,2.89 ANT.2 19.1,2.8 19.1,6.6 18.68,7.02 D1.K
  Top 0.254: D1.K 18.08,8 C3.1
SE1L
  Top 0.305: C35.2 70.52,45.97 TDA.9
SE1R
  Top 0.305: C34.2 70.37,47.24 TDA.10
SE2L
  Top 0.305: C37.2 70.73,43.43 TDA.7
SE2R
  Top 0.305: C36.2 70.68,44.7 TDA.8
SE3L
  Top 0.305: C39.2 70.42,40.89 TDA.5
SE3R
  Top 0.305: C38.2 70.57,42.16 TDA.6
SI4688_LOUT  (via drill 0.33)
  Top 0.152: IC2.18 21.94,16.86 22.55,17.48 22.55,18.49 23.37,19.3 23.37,20.22 24.28,21.13 C14.1 25.86,21.84 42.47,21.84 43.28,22.66 43.38,22.76 54.25,33.63 61.98,33.63 66.55,38.2 v66.55,39.73 | C39.1 73.27,39.83 v73.66,39.83
  Bottom 0.152: v66.55,39.73 73.56,39.73 v73.66,39.83
SI4688_ROUT  (via drill 0.33)
  Top 0.152: IC2.19 21.83,17.36 22.15,17.68 22.15,18.59 23.06,19.51 23.06,20.83 23.67,21.44 C15.1 24.33,21.79 24.69,22.15 42.27,22.15 54.05,33.93 61.77,33.93 65.84,38 65.84,40.34 v66.55,41.05 | C38.1 73.27,41.25 v73.66,41.25
  Bottom 0.152: v66.55,41.05 73.46,41.05 v73.66,41.25
SI4688_RSTB  (via drill 0.33)
  Top 0.152: R29.1 11.21,9.79 12.39,10.97 15.54,10.97 16.76,12.19 16.76,12.7 | 16.76,12.7 16.76,13.56 IC2.4 | v16.87,12.7 16.76,12.7 | v33.43,19.71 v36.88,19.71 | v44.3,40.74 44.7,41.15 44.7,41.55 45.08,41.94 U6.42
  Bottom 0.152: v16.87,12.7 17.37,12.7 18.69,14.02 24.79,14.02 26.31,12.5 26.31,10.26 27.03,9.55 28.14,9.55 28.75,10.16 28.75,17.68 30.78,19.71 v33.43,19.71 | v44.3,40.74 44.3,40.64 44.5,40.44 45.82,40.44 47.45,38.81 47.45,29.97 37.19,19.71 v36.88,19.71

### Text on the board
tPlace: Car Radio / Main Board | John Turner / v1.0 2015
tNames: ATMEGA2560
bNames: L | R | L | R